# Altium project LIDO_HW_2022_04_V01.PrjPcb (part 1 of 3)
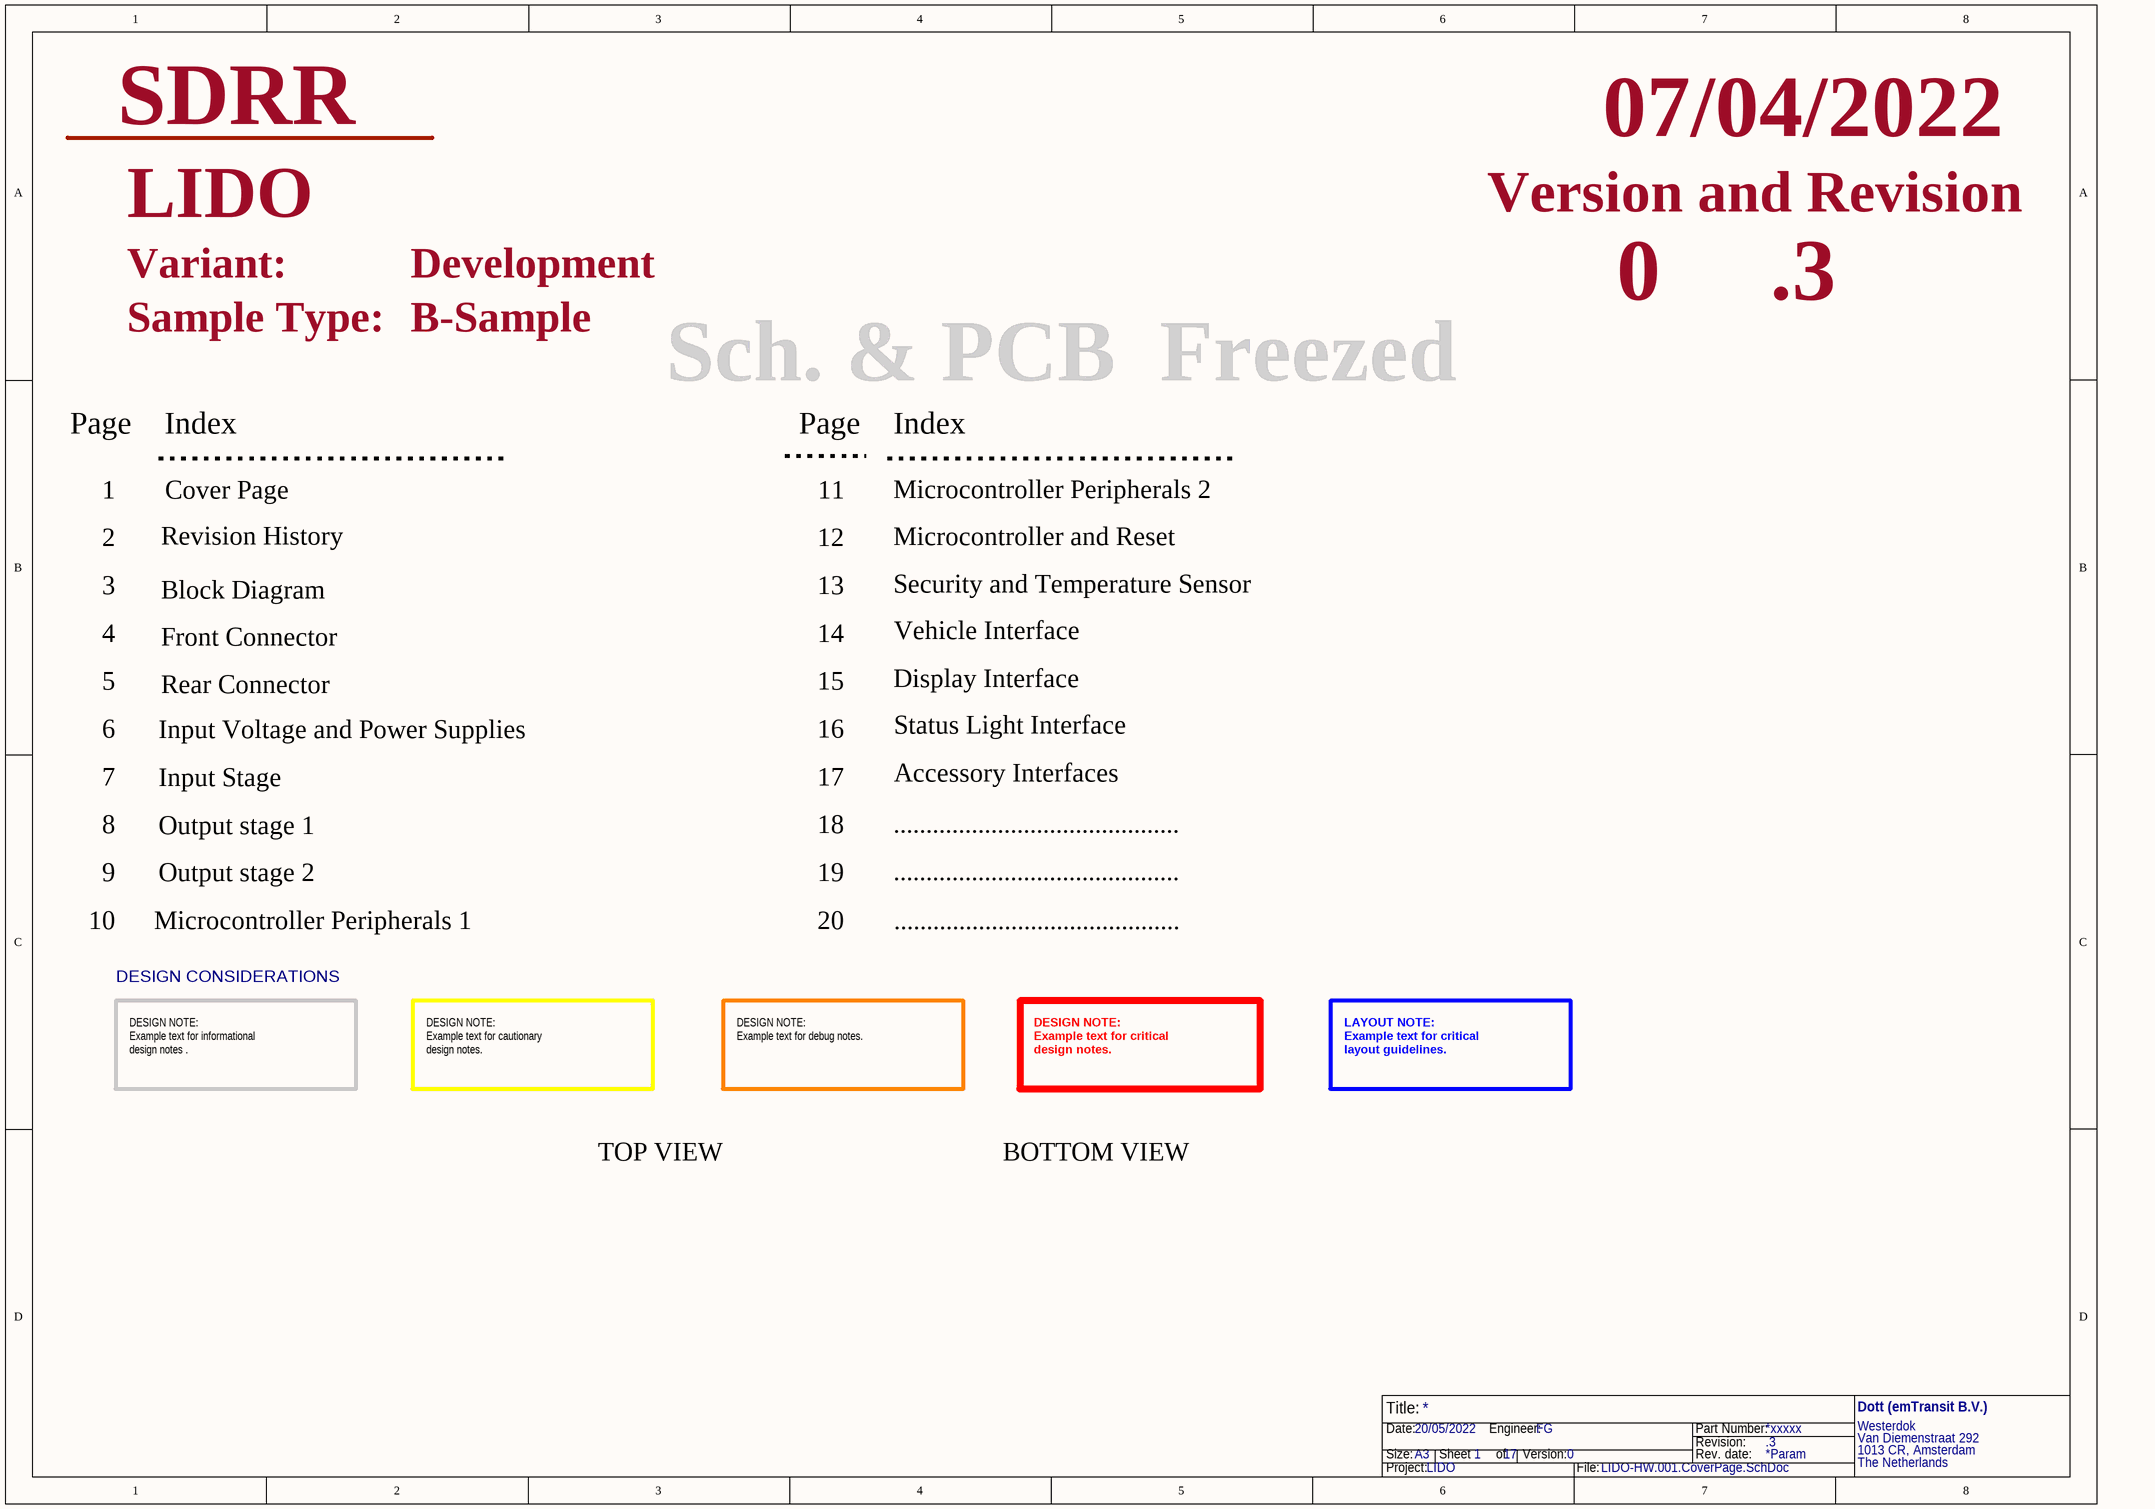
[diagram p0: LIDO-HW.001.CoverPage.SchDoc]
Company_Name: Dott (emTransit B.V.); CompanyAddress1: Westerdok; CompanyAddress2: Van Diemenstraat 292; CompanyAddress3: 1013 CR, Amsterdam; CompanyAddress4: The Netherlands; EngineeringSample: B-Sample; FileGeneration_Date: 04_07_2022; HardwareDesigner: FG; HardwareDesignerAbb: *Param; MainProjectName: SDRR; OutputJobFilesName: LIDO_V03; PopulateLabel: DNI; Project_Version: 0; Project_VersionDate: 20/05/2022; ProjectBoardName: LIDO; ProjectNumber: *xxxxx; ProjectRevision: .3; ProjectRevisionDate: *Param; ProjectStartDate: 07/04/2022; ProjectVariant: Development; Release_Date: 30/06/2022; Reviewer: *Param; ReviewerAbb: *Param
17 sheets, 459 parts. Net scope: hierarchical (ports join the sheet entries above them; power ports are global).
Board file: LIDO_HW_2022_04_V01.PcbDoc
Sheets:
  LIDO-HW.001.CoverPage.SchDoc
  LIDO-HW.002.RevisionHistory.SchDoc
  LIDO-HW.003.BlockDiagram.SchDoc
    U_LIDO-HW.100.FrontConnector = LIDO-HW.100.FrontConnector.SchDoc
    U_LIDO-HW.100.RearConnector = LIDO-HW.100.RearConnector.SchDoc
    U_LIDO-HW.100.VinAndPower = LIDO-HW.100.VinAndPower.SchDoc
    U_LIDO-HW.100.InputStage_1 = LIDO-HW.100.InputStage_1.SchDoc
    U_LIDO-HW.100.InputStage_2 = LIDO-HW.100.InputStage_2.SchDoc
    U_LIDO-HW.100.OutputStage = LIDO-HW.100.OutputStage.SchDoc
    U_LIDO-HW.200.MCU_Peripherals_1 = LIDO-HW.200.MCU_Peripherals_1.SchDoc
    U_LIDO-HW.200.MCU_Peripherals_2 = LIDO-HW.200.MCU_Peripherals_2.SchDoc
    U_LIDO-HW.200.MCU_SWD_Reset = LIDO-HW.200.MCU_SWD_Reset.SchDoc
    U_LIDO-HW.200.SecurityAndTemperature = LIDO-HW.200.SecurityAndTemperature.SchDoc
    U_LIDO-HW.300.VehicleInterface = LIDO-HW.300.VehicleInterface.SchDoc
    U_LIDO-HW.300.DisplayInterface = LIDO-HW.300.DisplayInterface.SchDoc
    U_LIDO-HW.300.StatusLightInterface = LIDO-HW.300.StatusLightInterface.SchDoc
    U_LIDO-HW.400.AccessoryInterfaces = LIDO-HW.400.AccessoryInterfaces.SchDoc

## Sheet LIDO-HW.001.CoverPage.SchDoc
size A3; CompanyName: EST-Floattech; DrawnBy: RR; Organization: EST-Floattech; Address2: Zandsteen 1; Address3: 2132 MZ; Address4: Hoofddorp; DocumentNumber: 21xxx; Revision: 1.0; SheetNumber: 1; SheetTotal: 17

### Notes on the sheet
- Version and Revision
- Variant:
- Sample Type:
- Page
- Index
- Sch. & PCB  Freezed
- 1
- Cover Page
- 11
- Microcontroller Peripherals 2
- 2
- Revision History
- 12
- Microcontroller and Reset
- 3
- 4
- Block Diagram
- Front Connector
- 13
- 14
- Security and Temperature Sensor
- Vehicle Interface
- 5
- Rear Connector
- 15
- Display Interface
- 6
- 7
- Input Voltage and Power Supplies
- Input Stage
- 16
- 17
- Status Light Interface
- Accessory Interfaces
- 8
- Output stage 1
- 18
- ............................................
- 9
- Output stage 2
- 19
- DESIGN CONSIDERATIONS
- 10
- Microcontroller Peripherals 1
- 20
- DESIGN NOTE:
  Example text for informational
  design notes .
- DESIGN NOTE:
  Example text for cautionary
  design notes.
- DESIGN NOTE:
  Example text for debug notes.
- DESIGN NOTE:
  Example text for critical
  design notes.
- LAYOUT NOTE:
  Example text for critical
  layout guidelines.
- TOP VIEW
- BOTTOM VIEW
- Title:
- Size:
- Date:
- A3
- Sheet       of
- Engineer:
- Version:
- Part Number:
- Revision:
- Rev. date:
- Project:
- File:

## Sheet LIDO-HW.002.RevisionHistory.SchDoc
size A3; CompanyName: EST-Floattech; DrawnBy: RR; Organization: EST-Floattech; Address2: Zandsteen 1; Address3: 2132 MZ; Address4: Hoofddorp; DocumentNumber: 21xxx; Revision: 1.0; SheetNumber: 2; SheetTotal: 17
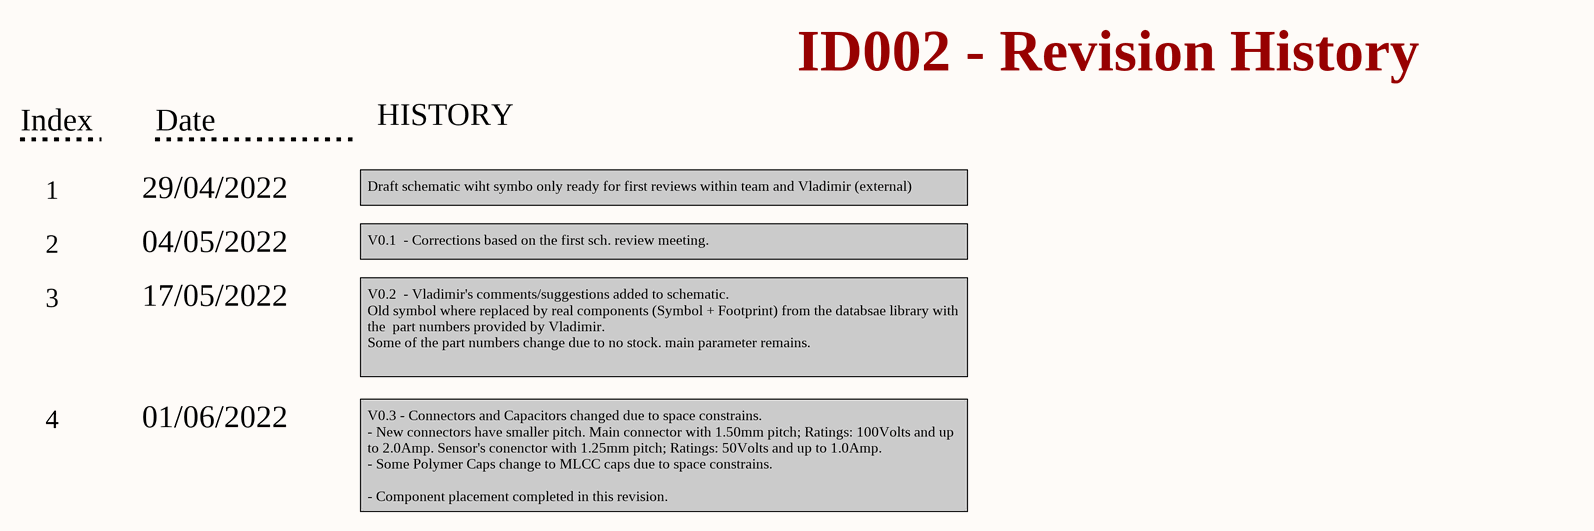
[diagram p1: LIDO-HW.002.RevisionHistory.SchDoc]

### Notes on the sheet
- Index
- Date
- HISTORY
- ID002 - Revision History
- 1
- 29/04/2022
- Draft schematic wiht symbo only ready for first reviews within team and Vladimir (external)
- 2
- 04/05/2022
- V0.1  - Corrections based on the first sch. review meeting.
- 3
- 17/05/2022
- V0.2  - Vladimir's comments/suggestions added to schematic.
  Old symbol where replaced by real components (Symbol + Footprint) from the databsae library with the  part numbers provided by Vladimir.
  Some of the part numbers change due to no stock. main parameter remains.
- 4
- 01/06/2022
- V0.3 - Connectors and Capacitors changed due to space constrains.
  - New connectors have smaller pitch. Main connector with 1.50mm pitch; Ratings: 100Volts and up to 2.0Amp. Sensor's conenctor with 1.25mm pitch; Ratings: 50Volts and up to 1.0Amp.
  - Some Polymer Caps change to MLCC caps due to space constrains.
  - Component placement completed in this revision.
- Title:
- Size:
- Date:
- A3
- Sheet       of
- Engineer:
- Version:
- Part Number:
- Revision:
- Rev. date:
- Project:
- File:

## Sheet LIDO-HW.003.BlockDiagram.SchDoc
size A3; CompanyName: EST-Floattech; DrawnBy: RR; Organization: EST-Floattech; Address2: Zandsteen 1; Address3: 2132 MZ; Address4: Hoofddorp; DocumentNumber: 21xxx; Revision: 1.0; SheetNumber: 3; SheetTotal: 17
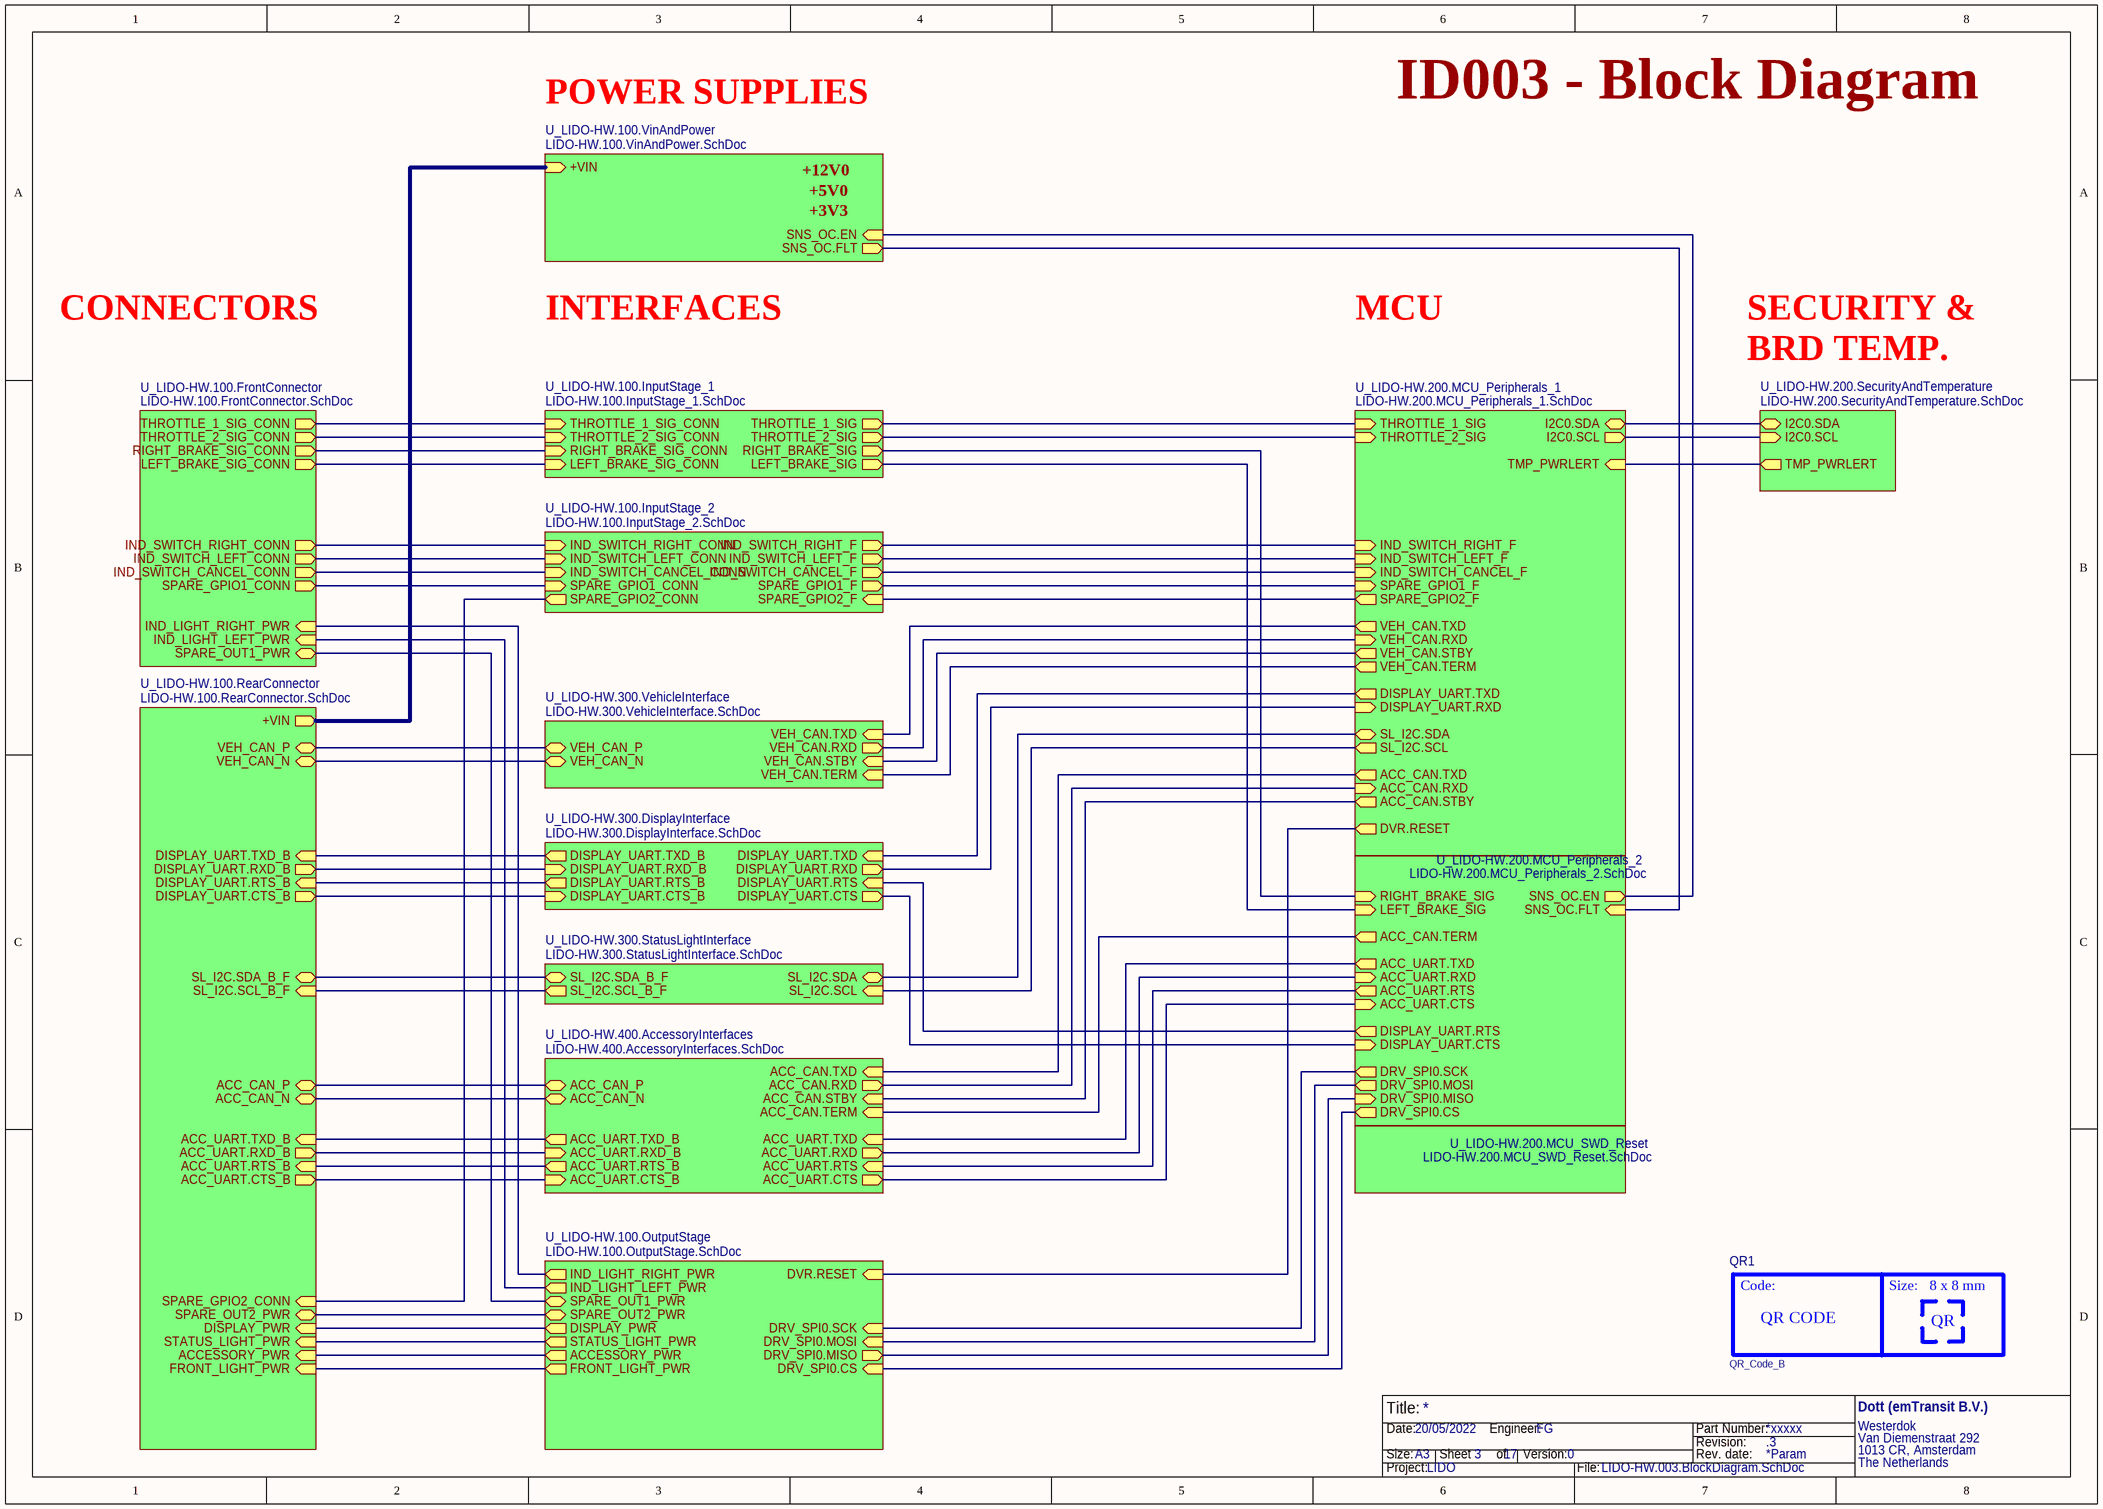
[diagram p2: LIDO-HW.003.BlockDiagram.SchDoc]

### Parts
QR1  QR_Code_B  [QR_CODE_8X8_A]  (no BOM)

### Sub-sheets
U_LIDO-HW.100.FrontConnector = LIDO-HW.100.FrontConnector.SchDoc: IND_LIGHT_LEFT_PWR (in), IND_LIGHT_RIGHT_PWR (in), THROTTLE_1_SIG_CONN (out), THROTTLE_2_SIG_CONN (out), RIGHT_BRAKE_SIG_CONN (out), LEFT_BRAKE_SIG_CONN (out), SPARE_OUT1_PWR (bidir), IND_SWITCH_CANCEL_CONN (out), SPARE_GPIO1_CONN (out), IND_SWITCH_LEFT_CONN (out), IND_SWITCH_RIGHT_CONN (out)
U_LIDO-HW.100.InputStage_1 = LIDO-HW.100.InputStage_1.SchDoc: THROTTLE_1_SIG (out), THROTTLE_1_SIG_CONN (in), THROTTLE_2_SIG (out), THROTTLE_2_SIG_CONN (in), RIGHT_BRAKE_SIG (out), RIGHT_BRAKE_SIG_CONN (in), LEFT_BRAKE_SIG (out), LEFT_BRAKE_SIG_CONN (in)
U_LIDO-HW.100.InputStage_2 = LIDO-HW.100.InputStage_2.SchDoc: IND_SWITCH_LEFT_F (out), IND_SWITCH_LEFT_CONN (in), IND_SWITCH_RIGHT_CONN (in), IND_SWITCH_RIGHT_F (out), SPARE_GPIO1_CONN (in), IND_SWITCH_CANCEL_CONN (in), IND_SWITCH_CANCEL_F (out), SPARE_GPIO2_CONN (out), SPARE_GPIO1_F (out), SPARE_GPIO2_F (in)
U_LIDO-HW.100.OutputStage = LIDO-HW.100.OutputStage.SchDoc: FRONT_LIGHT_PWR (out), IND_LIGHT_LEFT_PWR (out), IND_LIGHT_RIGHT_PWR (out), ACCESSORY_PWR (out), STATUS_LIGHT_PWR (out), SPARE_OUT2_PWR (bidir), SPARE_OUT1_PWR (bidir), DISPLAY_PWR (out), DRV_SPI0.MISO (out), DRV_SPI0.SCK (in), DRV_SPI0.MOSI (in), DRV_SPI0.CS (in), DVR.RESET (in)
U_LIDO-HW.100.RearConnector = LIDO-HW.100.RearConnector.SchDoc: ACC_CAN_P (bidir), ACC_CAN_N (bidir), ACC_UART.TXD_B (in), ACC_UART.RXD_B (out), ACC_UART.CTS_B (out), ACC_UART.RTS_B (in), SL_I2C.SDA_B_F (bidir), SL_I2C.SCL_B_F (in), FRONT_LIGHT_PWR (in), VEH_CAN_P (bidir), VEH_CAN_N (bidir), DISPLAY_UART.TXD_B (in), DISPLAY_UART.RXD_B (out), DISPLAY_PWR (in), STATUS_LIGHT_PWR (in), ACCESSORY_PWR (in), SPARE_OUT2_PWR (bidir), SPARE_GPIO2_CONN (in), DISPLAY_UART.RTS_B (in), DISPLAY_UART.CTS_B (out), +VIN (out)
U_LIDO-HW.100.VinAndPower = LIDO-HW.100.VinAndPower.SchDoc: SNS_OC.FLT (out), SNS_OC.EN (in), +VIN (in)
U_LIDO-HW.200.MCU_Peripherals_1 = LIDO-HW.200.MCU_Peripherals_1.SchDoc: I2C0.SDA (bidir), I2C0.SCL (out), TMP_PWRLERT (in), VEH_CAN.TXD (out), VEH_CAN.RXD (in), VEH_CAN.STBY (out), ACC_CAN.TXD (out), ACC_CAN.RXD (in), ACC_CAN.STBY (out), VEH_CAN.TERM (out), SL_I2C.SDA (bidir), SL_I2C.SCL (out), DISPLAY_UART.TXD (out), DISPLAY_UART.RXD (in), THROTTLE_1_SIG (in), THROTTLE_2_SIG (in), IND_SWITCH_LEFT_F (in), IND_SWITCH_RIGHT_F (in), IND_SWITCH_CANCEL_F (in), DVR.RESET (out), SPARE_GPIO1_F (in), SPARE_GPIO2_F (out)
U_LIDO-HW.200.MCU_Peripherals_2 = LIDO-HW.200.MCU_Peripherals_2.SchDoc: ACC_UART.TXD (out), ACC_UART.RXD (in), ACC_UART.CTS (in), ACC_UART.RTS (out), DRV_SPI0.CS (out), RIGHT_BRAKE_SIG (in), LEFT_BRAKE_SIG (in), DRV_SPI0.MISO (in), DRV_SPI0.SCK (out), DRV_SPI0.MOSI (out), DISPLAY_UART.CTS (in), DISPLAY_UART.RTS (out), SNS_OC.FLT (in), SNS_OC.EN (out), ACC_CAN.TERM (out)
U_LIDO-HW.200.MCU_SWD_Reset = LIDO-HW.200.MCU_SWD_Reset.SchDoc: no entries
U_LIDO-HW.200.SecurityAndTemperature = LIDO-HW.200.SecurityAndTemperature.SchDoc: I2C0.SDA (bidir), I2C0.SCL (in), TMP_PWRLERT (out)
U_LIDO-HW.300.DisplayInterface = LIDO-HW.300.DisplayInterface.SchDoc: DISPLAY_UART.TXD (in), DISPLAY_UART.RXD (out), DISPLAY_UART.CTS (out), DISPLAY_UART.RTS (in), DISPLAY_UART.TXD_B (out), DISPLAY_UART.RXD_B (in), DISPLAY_UART.CTS_B (in), DISPLAY_UART.RTS_B (out)
U_LIDO-HW.300.StatusLightInterface = LIDO-HW.300.StatusLightInterface.SchDoc: SL_I2C.SDA (bidir), SL_I2C.SCL (in), SL_I2C.SDA_B_F (bidir), SL_I2C.SCL_B_F (out)
U_LIDO-HW.300.VehicleInterface = LIDO-HW.300.VehicleInterface.SchDoc: VEH_CAN.TXD (in), VEH_CAN.RXD (out), VEH_CAN.STBY (in), VEH_CAN.TERM (in), VEH_CAN_P (bidir), VEH_CAN_N (bidir)
U_LIDO-HW.400.AccessoryInterfaces = LIDO-HW.400.AccessoryInterfaces.SchDoc: ACC_CAN.TXD (in), ACC_CAN.RXD (out), ACC_CAN.STBY (in), ACC_UART.TXD (in), ACC_UART.RXD (out), ACC_UART.CTS (out), ACC_UART.RTS (in), ACC_UART.TXD_B (out), ACC_UART.RXD_B (in), ACC_UART.CTS_B (in), ACC_UART.RTS_B (out), ACC_CAN_P (bidir), ACC_CAN_N (bidir), ACC_CAN.TERM (in)

### Nets
+VIN: sheet U_LIDO-HW.100.RearConnector/+VIN, sheet U_LIDO-HW.100.VinAndPower/+VIN
ACC_CAN.RXD: sheet U_LIDO-HW.200.MCU_Peripherals_1/ACC_CAN.RXD, sheet U_LIDO-HW.400.AccessoryInterfaces/ACC_CAN.RXD
ACC_CAN.STBY: sheet U_LIDO-HW.200.MCU_Peripherals_1/ACC_CAN.STBY, sheet U_LIDO-HW.400.AccessoryInterfaces/ACC_CAN.STBY
ACC_CAN.TERM: sheet U_LIDO-HW.200.MCU_Peripherals_2/ACC_CAN.TERM, sheet U_LIDO-HW.400.AccessoryInterfaces/ACC_CAN.TERM
ACC_CAN.TXD: sheet U_LIDO-HW.200.MCU_Peripherals_1/ACC_CAN.TXD, sheet U_LIDO-HW.400.AccessoryInterfaces/ACC_CAN.TXD
ACC_CAN_N: sheet U_LIDO-HW.100.RearConnector/ACC_CAN_N, sheet U_LIDO-HW.400.AccessoryInterfaces/ACC_CAN_N
ACC_CAN_P: sheet U_LIDO-HW.100.RearConnector/ACC_CAN_P, sheet U_LIDO-HW.400.AccessoryInterfaces/ACC_CAN_P
ACC_UART.CTS: sheet U_LIDO-HW.200.MCU_Peripherals_2/ACC_UART.CTS, sheet U_LIDO-HW.400.AccessoryInterfaces/ACC_UART.CTS
ACC_UART.CTS_B: sheet U_LIDO-HW.100.RearConnector/ACC_UART.CTS_B, sheet U_LIDO-HW.400.AccessoryInterfaces/ACC_UART.CTS_B
ACC_UART.RTS: sheet U_LIDO-HW.200.MCU_Peripherals_2/ACC_UART.RTS, sheet U_LIDO-HW.400.AccessoryInterfaces/ACC_UART.RTS
ACC_UART.RTS_B: sheet U_LIDO-HW.100.RearConnector/ACC_UART.RTS_B, sheet U_LIDO-HW.400.AccessoryInterfaces/ACC_UART.RTS_B
ACC_UART.RXD: sheet U_LIDO-HW.200.MCU_Peripherals_2/ACC_UART.RXD, sheet U_LIDO-HW.400.AccessoryInterfaces/ACC_UART.RXD
ACC_UART.RXD_B: sheet U_LIDO-HW.100.RearConnector/ACC_UART.RXD_B, sheet U_LIDO-HW.400.AccessoryInterfaces/ACC_UART.RXD_B
ACC_UART.TXD: sheet U_LIDO-HW.200.MCU_Peripherals_2/ACC_UART.TXD, sheet U_LIDO-HW.400.AccessoryInterfaces/ACC_UART.TXD
ACC_UART.TXD_B: sheet U_LIDO-HW.100.RearConnector/ACC_UART.TXD_B, sheet U_LIDO-HW.400.AccessoryInterfaces/ACC_UART.TXD_B
ACCESSORY_PWR: sheet U_LIDO-HW.100.RearConnector/ACCESSORY_PWR, sheet U_LIDO-HW.100.OutputStage/ACCESSORY_PWR
DISPLAY_PWR: sheet U_LIDO-HW.100.RearConnector/DISPLAY_PWR, sheet U_LIDO-HW.100.OutputStage/DISPLAY_PWR
DISPLAY_UART.CTS: sheet U_LIDO-HW.200.MCU_Peripherals_2/DISPLAY_UART.CTS, sheet U_LIDO-HW.300.DisplayInterface/DISPLAY_UART.CTS
DISPLAY_UART.CTS_B: sheet U_LIDO-HW.100.RearConnector/DISPLAY_UART.CTS_B, sheet U_LIDO-HW.300.DisplayInterface/DISPLAY_UART.CTS_B
DISPLAY_UART.RTS: sheet U_LIDO-HW.200.MCU_Peripherals_2/DISPLAY_UART.RTS, sheet U_LIDO-HW.300.DisplayInterface/DISPLAY_UART.RTS
DISPLAY_UART.RTS_B: sheet U_LIDO-HW.100.RearConnector/DISPLAY_UART.RTS_B, sheet U_LIDO-HW.300.DisplayInterface/DISPLAY_UART.RTS_B
DISPLAY_UART.RXD: sheet U_LIDO-HW.200.MCU_Peripherals_1/DISPLAY_UART.RXD, sheet U_LIDO-HW.300.DisplayInterface/DISPLAY_UART.RXD
DISPLAY_UART.RXD_B: sheet U_LIDO-HW.100.RearConnector/DISPLAY_UART.RXD_B, sheet U_LIDO-HW.300.DisplayInterface/DISPLAY_UART.RXD_B
DISPLAY_UART.TXD: sheet U_LIDO-HW.200.MCU_Peripherals_1/DISPLAY_UART.TXD, sheet U_LIDO-HW.300.DisplayInterface/DISPLAY_UART.TXD
DISPLAY_UART.TXD_B: sheet U_LIDO-HW.100.RearConnector/DISPLAY_UART.TXD_B, sheet U_LIDO-HW.300.DisplayInterface/DISPLAY_UART.TXD_B
DRV_SPI0.CS: sheet U_LIDO-HW.100.OutputStage/DRV_SPI0.CS, sheet U_LIDO-HW.200.MCU_Peripherals_2/DRV_SPI0.CS
DRV_SPI0.MISO: sheet U_LIDO-HW.100.OutputStage/DRV_SPI0.MISO, sheet U_LIDO-HW.200.MCU_Peripherals_2/DRV_SPI0.MISO
DRV_SPI0.MOSI: sheet U_LIDO-HW.100.OutputStage/DRV_SPI0.MOSI, sheet U_LIDO-HW.200.MCU_Peripherals_2/DRV_SPI0.MOSI
DRV_SPI0.SCK: sheet U_LIDO-HW.100.OutputStage/DRV_SPI0.SCK, sheet U_LIDO-HW.200.MCU_Peripherals_2/DRV_SPI0.SCK
DVR.RESET: sheet U_LIDO-HW.100.OutputStage/DVR.RESET, sheet U_LIDO-HW.200.MCU_Peripherals_1/DVR.RESET
FRONT_LIGHT_PWR: sheet U_LIDO-HW.100.RearConnector/FRONT_LIGHT_PWR, sheet U_LIDO-HW.100.OutputStage/FRONT_LIGHT_PWR
I2C0.SCL: sheet U_LIDO-HW.200.MCU_Peripherals_1/I2C0.SCL, sheet U_LIDO-HW.200.SecurityAndTemperature/I2C0.SCL
I2C0.SDA: sheet U_LIDO-HW.200.MCU_Peripherals_1/I2C0.SDA, sheet U_LIDO-HW.200.SecurityAndTemperature/I2C0.SDA
IND_LIGHT_LEFT_PWR: sheet U_LIDO-HW.100.FrontConnector/IND_LIGHT_LEFT_PWR, sheet U_LIDO-HW.100.OutputStage/IND_LIGHT_LEFT_PWR
IND_LIGHT_RIGHT_PWR: sheet U_LIDO-HW.100.FrontConnector/IND_LIGHT_RIGHT_PWR, sheet U_LIDO-HW.100.OutputStage/IND_LIGHT_RIGHT_PWR
IND_SWITCH_CANCEL_CONN: sheet U_LIDO-HW.100.FrontConnector/IND_SWITCH_CANCEL_CONN, sheet U_LIDO-HW.100.InputStage_2/IND_SWITCH_CANCEL_CONN
IND_SWITCH_CANCEL_F: sheet U_LIDO-HW.100.InputStage_2/IND_SWITCH_CANCEL_F, sheet U_LIDO-HW.200.MCU_Peripherals_1/IND_SWITCH_CANCEL_F
IND_SWITCH_LEFT_CONN: sheet U_LIDO-HW.100.FrontConnector/IND_SWITCH_LEFT_CONN, sheet U_LIDO-HW.100.InputStage_2/IND_SWITCH_LEFT_CONN
IND_SWITCH_LEFT_F: sheet U_LIDO-HW.100.InputStage_2/IND_SWITCH_LEFT_F, sheet U_LIDO-HW.200.MCU_Peripherals_1/IND_SWITCH_LEFT_F
IND_SWITCH_RIGHT_CONN: sheet U_LIDO-HW.100.FrontConnector/IND_SWITCH_RIGHT_CONN, sheet U_LIDO-HW.100.InputStage_2/IND_SWITCH_RIGHT_CONN
IND_SWITCH_RIGHT_F: sheet U_LIDO-HW.100.InputStage_2/IND_SWITCH_RIGHT_F, sheet U_LIDO-HW.200.MCU_Peripherals_1/IND_SWITCH_RIGHT_F
LEFT_BRAKE_SIG: sheet U_LIDO-HW.100.InputStage_1/LEFT_BRAKE_SIG, sheet U_LIDO-HW.200.MCU_Peripherals_2/LEFT_BRAKE_SIG
LEFT_BRAKE_SIG_CONN: sheet U_LIDO-HW.100.FrontConnector/LEFT_BRAKE_SIG_CONN, sheet U_LIDO-HW.100.InputStage_1/LEFT_BRAKE_SIG_CONN
RIGHT_BRAKE_SIG: sheet U_LIDO-HW.100.InputStage_1/RIGHT_BRAKE_SIG, sheet U_LIDO-HW.200.MCU_Peripherals_2/RIGHT_BRAKE_SIG
RIGHT_BRAKE_SIG_CONN: sheet U_LIDO-HW.100.FrontConnector/RIGHT_BRAKE_SIG_CONN, sheet U_LIDO-HW.100.InputStage_1/RIGHT_BRAKE_SIG_CONN
SL_I2C.SCL: sheet U_LIDO-HW.200.MCU_Peripherals_1/SL_I2C.SCL, sheet U_LIDO-HW.300.StatusLightInterface/SL_I2C.SCL
SL_I2C.SCL_B_F: sheet U_LIDO-HW.100.RearConnector/SL_I2C.SCL_B_F, sheet U_LIDO-HW.300.StatusLightInterface/SL_I2C.SCL_B_F
SL_I2C.SDA: sheet U_LIDO-HW.200.MCU_Peripherals_1/SL_I2C.SDA, sheet U_LIDO-HW.300.StatusLightInterface/SL_I2C.SDA
SL_I2C.SDA_B_F: sheet U_LIDO-HW.100.RearConnector/SL_I2C.SDA_B_F, sheet U_LIDO-HW.300.StatusLightInterface/SL_I2C.SDA_B_F
SNS_OC.EN: sheet U_LIDO-HW.100.VinAndPower/SNS_OC.EN, sheet U_LIDO-HW.200.MCU_Peripherals_2/SNS_OC.EN
SNS_OC.FLT: sheet U_LIDO-HW.100.VinAndPower/SNS_OC.FLT, sheet U_LIDO-HW.200.MCU_Peripherals_2/SNS_OC.FLT
SPARE_GPIO1_CONN: sheet U_LIDO-HW.100.FrontConnector/SPARE_GPIO1_CONN, sheet U_LIDO-HW.100.InputStage_2/SPARE_GPIO1_CONN
SPARE_GPIO1_F: sheet U_LIDO-HW.100.InputStage_2/SPARE_GPIO1_F, sheet U_LIDO-HW.200.MCU_Peripherals_1/SPARE_GPIO1_F
SPARE_GPIO2_CONN: sheet U_LIDO-HW.100.RearConnector/SPARE_GPIO2_CONN, sheet U_LIDO-HW.100.InputStage_2/SPARE_GPIO2_CONN
SPARE_GPIO2_F: sheet U_LIDO-HW.100.InputStage_2/SPARE_GPIO2_F, sheet U_LIDO-HW.200.MCU_Peripherals_1/SPARE_GPIO2_F
SPARE_OUT1_PWR: sheet U_LIDO-HW.100.FrontConnector/SPARE_OUT1_PWR, sheet U_LIDO-HW.100.OutputStage/SPARE_OUT1_PWR
SPARE_OUT2_PWR: sheet U_LIDO-HW.100.RearConnector/SPARE_OUT2_PWR, sheet U_LIDO-HW.100.OutputStage/SPARE_OUT2_PWR
STATUS_LIGHT_PWR: sheet U_LIDO-HW.100.RearConnector/STATUS_LIGHT_PWR, sheet U_LIDO-HW.100.OutputStage/STATUS_LIGHT_PWR
THROTTLE_1_SIG: sheet U_LIDO-HW.100.InputStage_1/THROTTLE_1_SIG, sheet U_LIDO-HW.200.MCU_Peripherals_1/THROTTLE_1_SIG
THROTTLE_1_SIG_CONN: sheet U_LIDO-HW.100.FrontConnector/THROTTLE_1_SIG_CONN, sheet U_LIDO-HW.100.InputStage_1/THROTTLE_1_SIG_CONN
THROTTLE_2_SIG: sheet U_LIDO-HW.100.InputStage_1/THROTTLE_2_SIG, sheet U_LIDO-HW.200.MCU_Peripherals_1/THROTTLE_2_SIG
THROTTLE_2_SIG_CONN: sheet U_LIDO-HW.100.FrontConnector/THROTTLE_2_SIG_CONN, sheet U_LIDO-HW.100.InputStage_1/THROTTLE_2_SIG_CONN
TMP_PWRLERT: sheet U_LIDO-HW.200.MCU_Peripherals_1/TMP_PWRLERT, sheet U_LIDO-HW.200.SecurityAndTemperature/TMP_PWRLERT
VEH_CAN.RXD: sheet U_LIDO-HW.200.MCU_Peripherals_1/VEH_CAN.RXD, sheet U_LIDO-HW.300.VehicleInterface/VEH_CAN.RXD
VEH_CAN.STBY: sheet U_LIDO-HW.200.MCU_Peripherals_1/VEH_CAN.STBY, sheet U_LIDO-HW.300.VehicleInterface/VEH_CAN.STBY
VEH_CAN.TERM: sheet U_LIDO-HW.200.MCU_Peripherals_1/VEH_CAN.TERM, sheet U_LIDO-HW.300.VehicleInterface/VEH_CAN.TERM
VEH_CAN.TXD: sheet U_LIDO-HW.200.MCU_Peripherals_1/VEH_CAN.TXD, sheet U_LIDO-HW.300.VehicleInterface/VEH_CAN.TXD
VEH_CAN_N: sheet U_LIDO-HW.100.RearConnector/VEH_CAN_N, sheet U_LIDO-HW.300.VehicleInterface/VEH_CAN_N
VEH_CAN_P: sheet U_LIDO-HW.100.RearConnector/VEH_CAN_P, sheet U_LIDO-HW.300.VehicleInterface/VEH_CAN_P

### Notes on the sheet
- POWER SUPPLIES
- ID003 - Block Diagram
- +12V0
- +5V0
- +3V3
- CONNECTORS
- INTERFACES
- MCU
- SECURITY &
- BRD TEMP.
- Title:
- Size:
- Date:
- A3
- Sheet       of
- Engineer:
- Version:
- Part Number:
- Revision:
- Rev. date:
- Project:
- File:
- (in symbol 25) Code:; Size:; 8 x 8 mm; QR CODE; QR

### Library data of the parts
QR1 = 25: QR Code 8x8mm; Part Value: Legend; Obsolete Part: False; Component ID: 25; Label: QR_Code_B; Part Type: no BOM

## Sheet LIDO-HW.100.FrontConnector.SchDoc
size A3; CompanyName: EST-Floattech; DrawnBy: RR; Organization: EST-Floattech; Address2: Zandsteen 1; Address3: 2132 MZ; Address4: Hoofddorp; DocumentNumber: 21xxx; Revision: 1.0; SheetNumber: 4; SheetTotal: 17
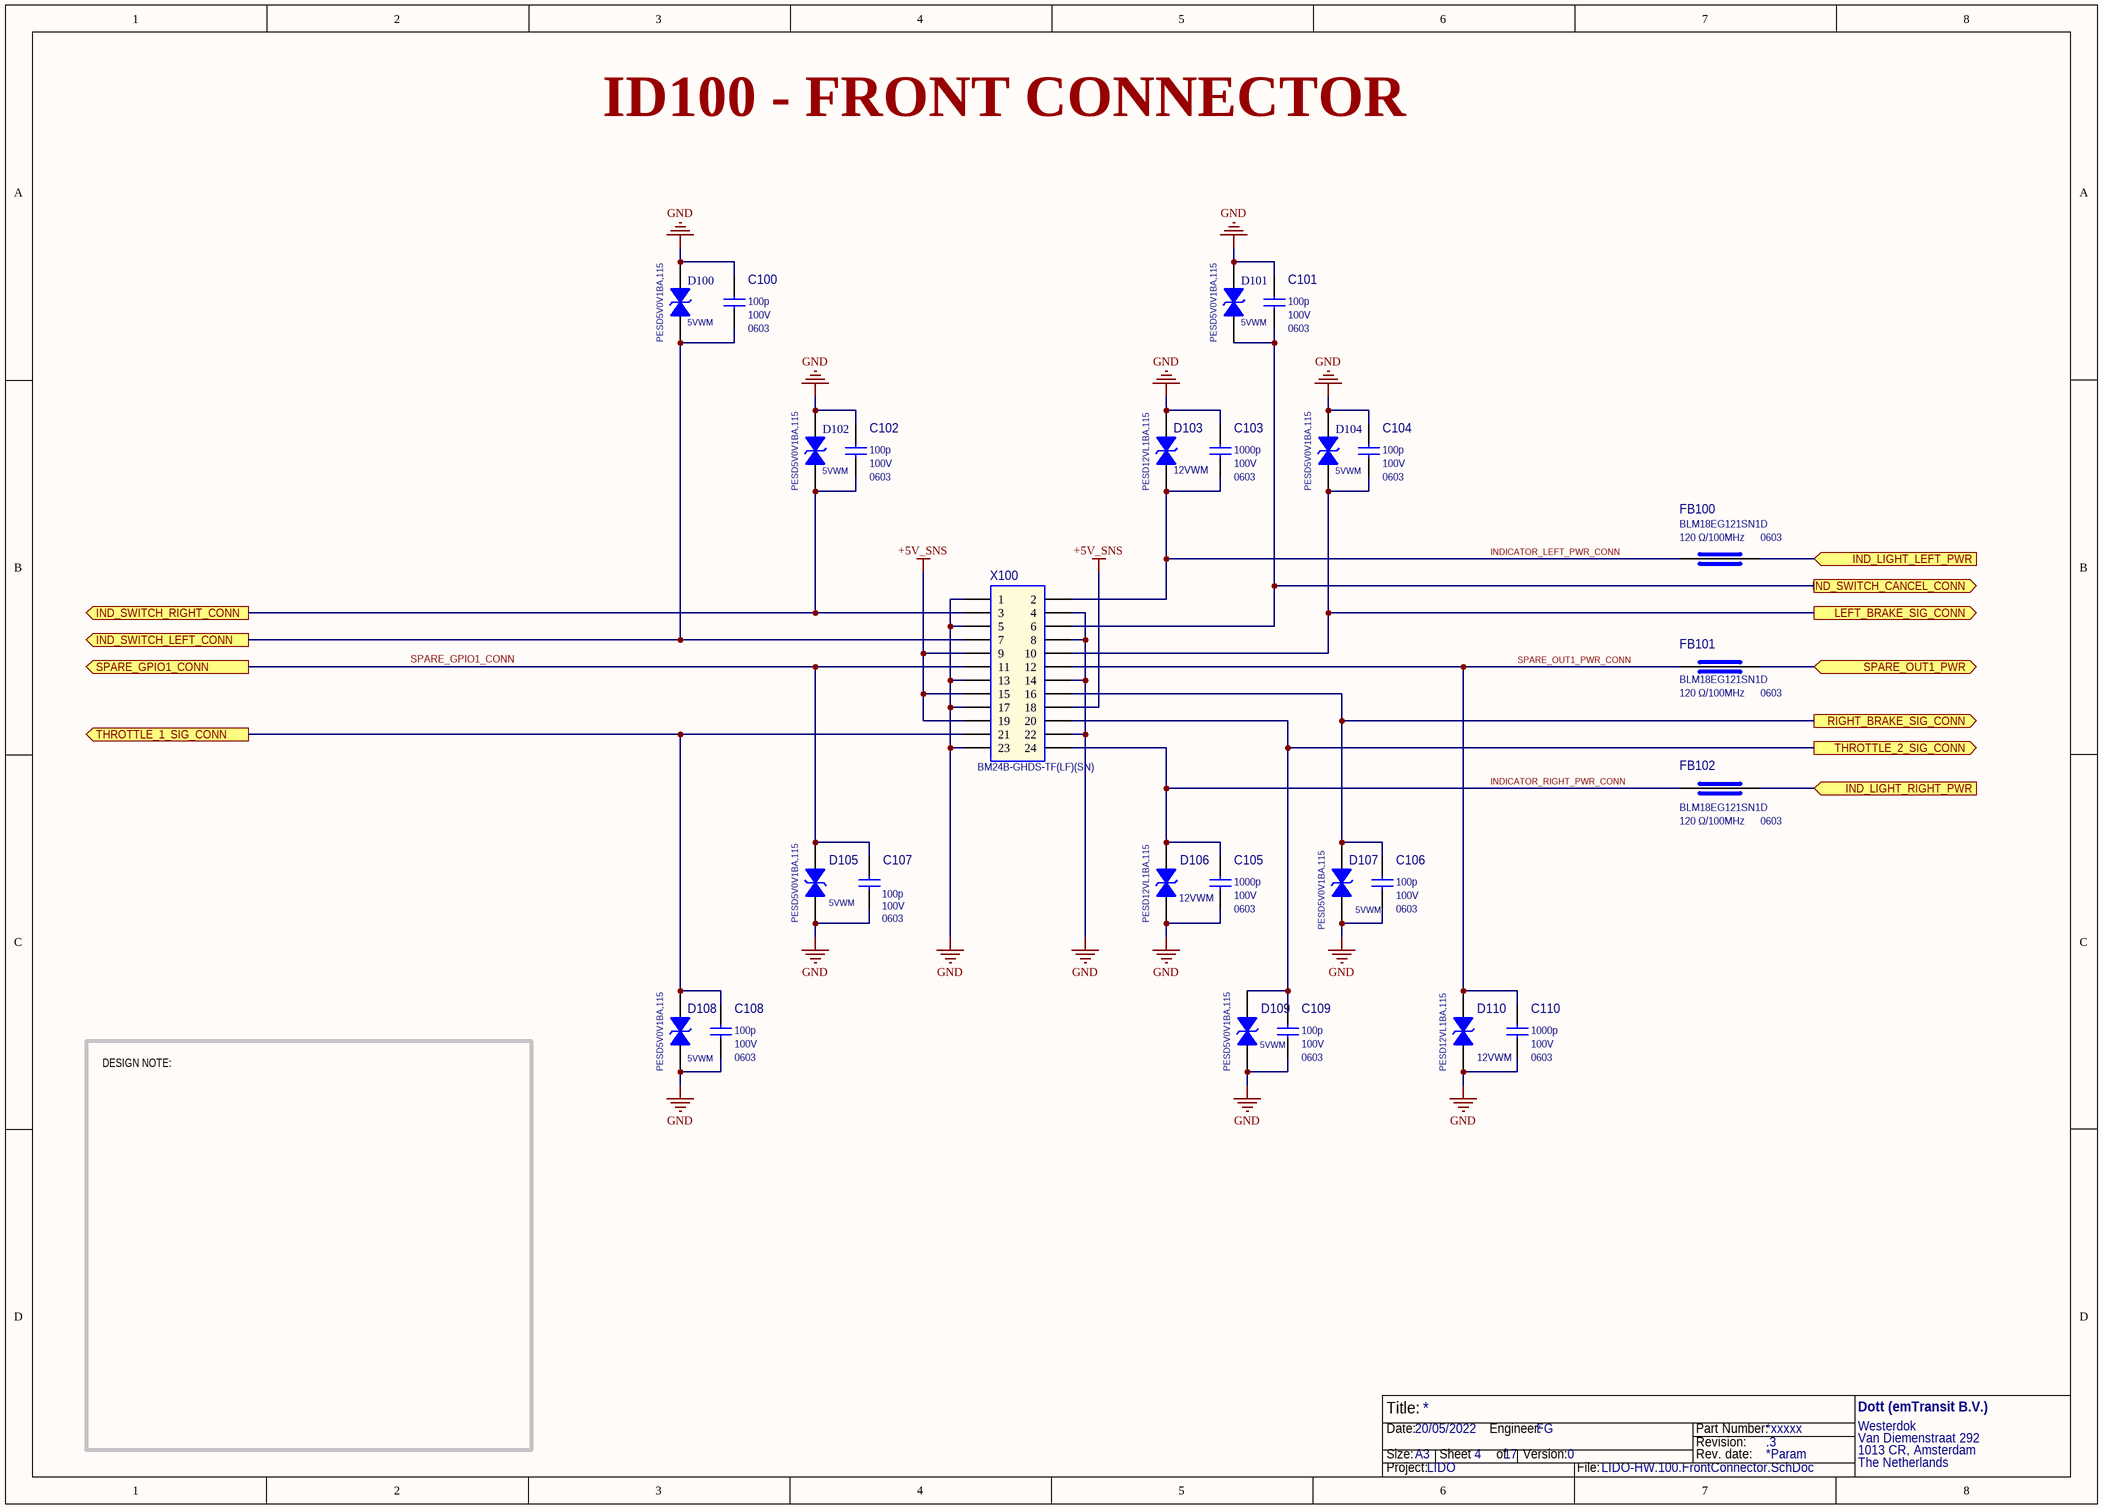
[diagram p3: LIDO-HW.100.FrontConnector.SchDoc]

### Parts
C100  Part Value 2: 100V  Part Package: 0603  [CAP_0603_1608X90-N_MURATA_A]  (hidden comment: 100p)
C101  Part Value 2: 100V  Part Package: 0603  [CAP_0603_1608X90-N_MURATA_A]  (hidden comment: 100p)
C102  Part Value 2: 100V  Part Package: 0603  [CAP_0603_1608X90-N_MURATA_A]  (hidden comment: 100p)
C103  Part Value 2: 100V  Part Package: 0603  [CAP_0603_1608X90-N_MURATA_A]  (hidden comment: 1000p)
C104  Part Value 2: 100V  Part Package: 0603  [CAP_0603_1608X90-N_MURATA_A]  (hidden comment: 100p)
C105  Part Value 2: 100V  Part Package: 0603  [CAP_0603_1608X90-N_MURATA_A]  (hidden comment: 1000p)
C106  Part Value 2: 100V  Part Package: 0603  [CAP_0603_1608X90-N_MURATA_A]  (hidden comment: 100p)
C107  Part Value 2: 100V  Part Package: 0603  [CAP_0603_1608X90-N_MURATA_A]  (hidden comment: 100p)
C108  Part Value 2: 100V  Part Package: 0603  [CAP_0603_1608X90-N_MURATA_A]  (hidden comment: 100p)
C109  Part Value 2: 100V  Part Package: 0603  [CAP_0603_1608X90-N_MURATA_A]  (hidden comment: 100p)
C110  Part Value 2: 100V  Part Package: 0603  [CAP_0603_1608X90-N_MURATA_A]  (hidden comment: 1000p)
D100  Manufacturer Part Number: PESD5V0V1BA,115  [NXP_SOD-323_250X125X95L30x32_A]  (hidden comment: 5VWM)
D101  Manufacturer Part Number: PESD5V0V1BA,115  [NXP_SOD-323_250X125X95L30x32_A]  (hidden comment: 5VWM)
D102  Manufacturer Part Number: PESD5V0V1BA,115  [NXP_SOD-323_250X125X95L30x32_A]  (hidden comment: 5VWM)
D103  Manufacturer Part Number: PESD12VL1BA,115  [NXP_SOD-323_250X125X95L30x32_A]  (hidden comment: 12VWM)
D104  Manufacturer Part Number: PESD5V0V1BA,115  [NXP_SOD-323_250X125X95L30x32_A]  (hidden comment: 5VWM)
D105  Manufacturer Part Number: PESD5V0V1BA,115  [NXP_SOD-323_250X125X95L30x32_A]  (hidden comment: 5VWM)
D106  Manufacturer Part Number: PESD12VL1BA,115  [NXP_SOD-323_250X125X95L30x32_A]  (hidden comment: 12VWM)
D107  Manufacturer Part Number: PESD5V0V1BA,115  [NXP_SOD-323_250X125X95L30x32_A]  (hidden comment: 5VWM)
D108  Manufacturer Part Number: PESD5V0V1BA,115  [NXP_SOD-323_250X125X95L30x32_A]  (hidden comment: 5VWM)
D109  Manufacturer Part Number: PESD5V0V1BA,115  [NXP_SOD-323_250X125X95L30x32_A]  (hidden comment: 5VWM)
D110  Manufacturer Part Number: PESD12VL1BA,115  [NXP_SOD-323_250X125X95L30x32_A]  (hidden comment: 12VWM)
FB100  Manufacturer Part Number: BLM18EG121SN1D  Part Package: 0603  [IND_0603_1608X95-N_AVX_A]  (hidden comment: 120 Ω/100MHz)
FB101  Manufacturer Part Number: BLM18EG121SN1D  Part Package: 0603  [IND_0603_1608X95-N_AVX_A]  (hidden comment: 120 Ω/100MHz)
FB102  Manufacturer Part Number: BLM18EG121SN1D  Part Package: 0603  [IND_0603_1608X95-N_AVX_A]  (hidden comment: 120 Ω/100MHz)
X100  BM24B-GHDS-TF(LF)(SN)  [JST_BM24B-GHDS-TF_A]

### Ports
IND_LIGHT_LEFT_PWR (in), IND_LIGHT_RIGHT_PWR (in), IND_SWITCH_CANCEL_CONN (out), IND_SWITCH_LEFT_CONN (out), IND_SWITCH_RIGHT_CONN (out), LEFT_BRAKE_SIG_CONN (out), RIGHT_BRAKE_SIG_CONN (out), SPARE_GPIO1_CONN (out), SPARE_OUT1_PWR (bidir), THROTTLE_1_SIG_CONN (out), THROTTLE_2_SIG_CONN (out)

### Nets
+5V_SNS: X100.9 X100.15 X100.18 X100.19
GND: C100.1 C101.1 C102.1 C103.1 C104.1 C105.2 C106.2 C107.1 C108.2 C109.2 C110.2 D100.A D101.A D102.A D103.A D104.A D105.A D106.A D107.A D108.A D109.A D110.A X100.1 X100.4 X100.5 X100.8 X100.13 X100.14 X100.17 X100.22 X100.23
IND_LIGHT_LEFT_PWR: FB100.2 ; port IND_LIGHT_LEFT_PWR
IND_LIGHT_RIGHT_PWR: FB102.2 ; port IND_LIGHT_RIGHT_PWR
IND_SWITCH_CANCEL_CONN: C101.2 D101.C X100.6 ; port IND_SWITCH_CANCEL_CONN
IND_SWITCH_LEFT_CONN: C100.2 D100.C X100.7 ; port IND_SWITCH_LEFT_CONN
IND_SWITCH_RIGHT_CONN: C102.2 D102.C X100.3 ; port IND_SWITCH_RIGHT_CONN
INDICATOR_LEFT_PWR_CONN: C103.2 D103.C FB100.1 X100.2
INDICATOR_RIGHT_PWR_CONN: C105.1 D106.C FB102.1 X100.24
LEFT_BRAKE_SIG_CONN: C104.2 D104.C X100.10 ; port LEFT_BRAKE_SIG_CONN
RIGHT_BRAKE_SIG_CONN: C106.1 D107.C X100.16 ; port RIGHT_BRAKE_SIG_CONN
SPARE_GPIO1_CONN: C107.2 D105.C X100.11 ; port SPARE_GPIO1_CONN
SPARE_OUT1_PWR: FB101.1 ; port SPARE_OUT1_PWR
SPARE_OUT1_PWR_CONN: C110.1 D110.C FB101.2 X100.12
THROTTLE_1_SIG_CONN: C108.1 D108.C X100.21 ; port THROTTLE_1_SIG_CONN
THROTTLE_2_SIG_CONN: C109.1 D109.C X100.20 ; port THROTTLE_2_SIG_CONN

### Notes on the sheet
- ID100 - FRONT CONNECTOR
- DESIGN NOTE:
- Title:
- Size:
- Date:
- A3
- Sheet       of
- Engineer:
- Version:
- Part Number:
- Revision:
- Rev. date:
- Project:
- File:

### Library data of the parts
C100-C102 C104 C106-C109 = 75: CAP CER 100PF 100V C0G 0603; Manufacturer Part Number: CGA3E2C0G2A101J080AA; Manufacturer: TDK Corporation; Obsolete Part: False; Component ID: 75; Part Value: 100p; Part Value 3: 5%; Package Type: SMT
C103 C105 C110 = 84: CAP CER 1000PF 100V X7R 0603; Manufacturer Part Number: CGA3E2X7R2A102K080AA; Manufacturer: TDK Corporation; Obsolete Part: False; Component ID: 84; Part Value: 1000p; Part Value 3: X7R; Package Type: SMT
D100-D102 D104 D105 D107-D109 = 32: 12.5V Clamp 4.8A (8/20µs) Ipp Tvs Diode Surface Mount SOD-323; Manufacturer: Nexperia USA Inc.; Part Package: SOD323; Obsolete Part: False; Component ID: 32; Part Type: TVS; Part Value: 5VWM; Package Type: SMT
D103 D106 D110 = 33: 37V Clamp 5A (8/20µs) Ipp Tvs Diode Surface Mount SOD-323; Manufacturer: Nexperia USA Inc.; Part Package: SOD323; Obsolete Part: False; Component ID: 33; Part Type: TVS; Part Value: 12VWM; Package Type: SMT
FB100-FB102 = 16: FERRITE BEAD 120 OHM 0603 1LN; Manufacturer: Murata Electronics; Obsolete Part: False; Component ID: 16; Part Value: 120 Ω/100MHz; Part Value 2: 2.0A; Package Type: SMT
X100 = 56: Connector Header Surface Mount 24 position 0.049" (1.25mm); Manufacturer: JST Sales America Inc.; Part Value: 24-Pins; Obsolete Part: False; Component ID: 56; Manufacturer Part Number: BM24B-GHDS-TF(LF)(SN); Part Pitch: 1.25mm

## Sheet LIDO-HW.100.RearConnector.SchDoc
size A3; SheetNumber: 5; SheetTotal: 17
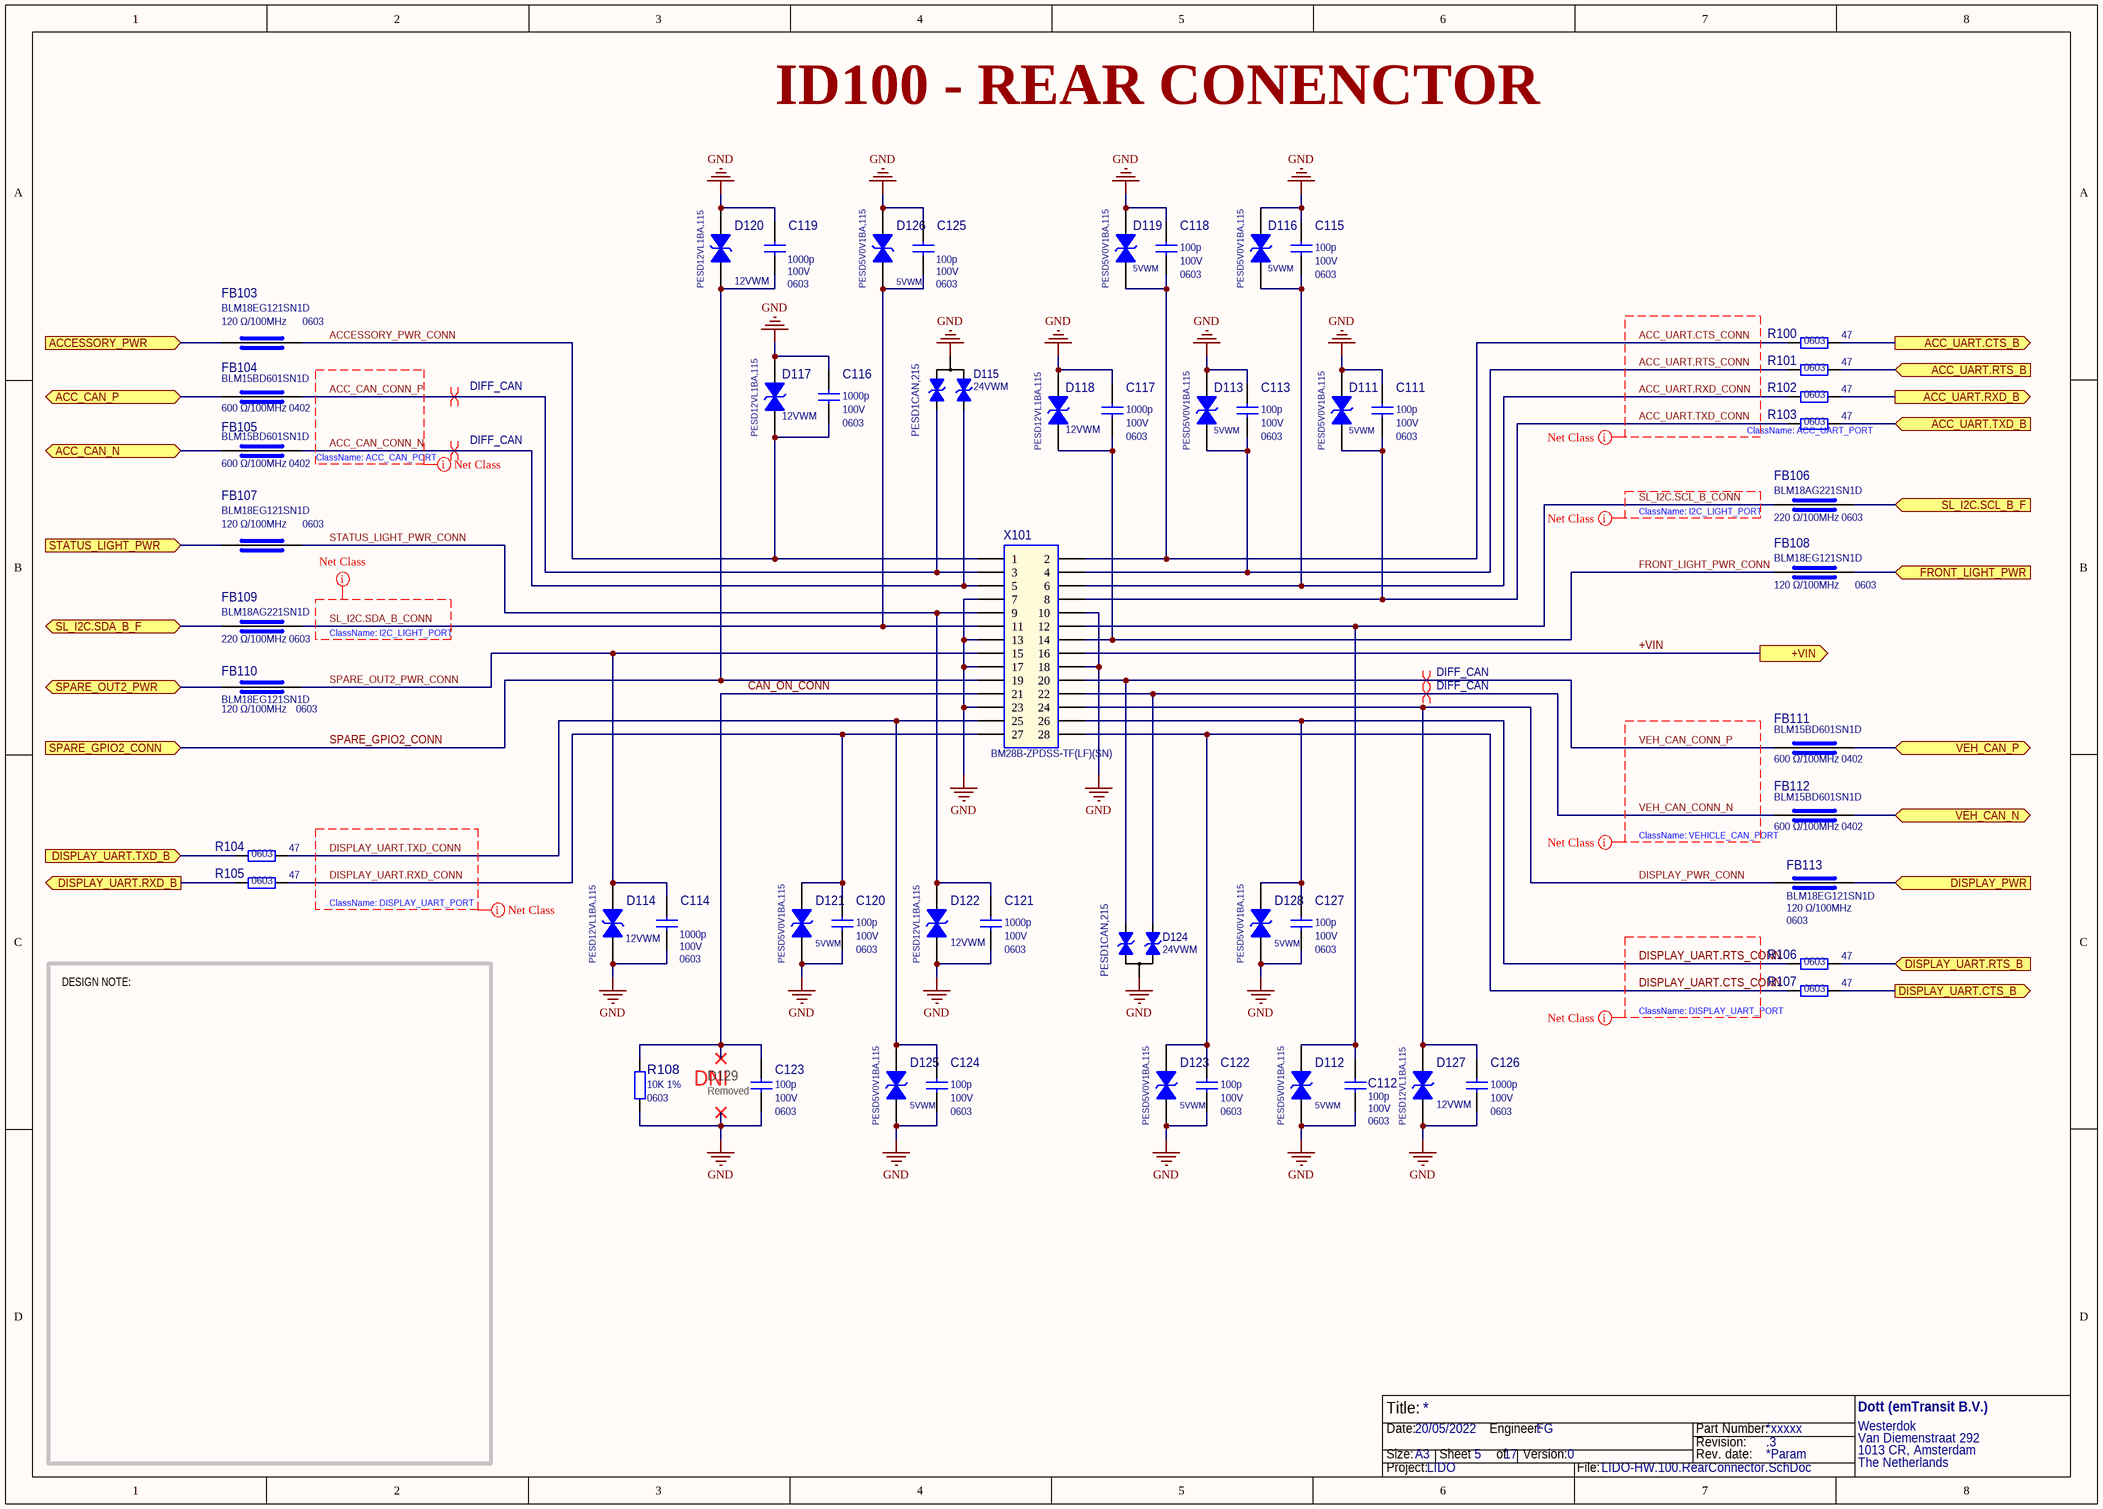
[diagram p4: LIDO-HW.100.RearConnector.SchDoc]

### Parts
C111  Part Value 2: 100V  Part Package: 0603  [CAP_0603_1608X90-N_MURATA_A]  (hidden comment: 100p)
C112  Part Value 2: 100V  Part Package: 0603  [CAP_0603_1608X90-N_MURATA_A]  (hidden comment: 100p)
C113  Part Value 2: 100V  Part Package: 0603  [CAP_0603_1608X90-N_MURATA_A]  (hidden comment: 100p)
C114  Part Value 2: 100V  Part Package: 0603  [CAP_0603_1608X90-N_MURATA_A]  (hidden comment: 1000p)
C115  Part Value 2: 100V  Part Package: 0603  [CAP_0603_1608X90-N_MURATA_A]  (hidden comment: 100p)
C116  Part Value 2: 100V  Part Package: 0603  [CAP_0603_1608X90-N_MURATA_A]  (hidden comment: 1000p)
C117  Part Value 2: 100V  Part Package: 0603  [CAP_0603_1608X90-N_MURATA_A]  (hidden comment: 1000p)
C118  Part Value 2: 100V  Part Package: 0603  [CAP_0603_1608X90-N_MURATA_A]  (hidden comment: 100p)
C119  Part Value 2: 100V  Part Package: 0603  [CAP_0603_1608X90-N_MURATA_A]  (hidden comment: 1000p)
C120  Part Value 2: 100V  Part Package: 0603  [CAP_0603_1608X90-N_MURATA_A]  (hidden comment: 100p)
C121  Part Value 2: 100V  Part Package: 0603  [CAP_0603_1608X90-N_MURATA_A]  (hidden comment: 1000p)
C122  Part Value 2: 100V  Part Package: 0603  [CAP_0603_1608X90-N_MURATA_A]  (hidden comment: 100p)
C123  Part Value 2: 100V  Part Package: 0603  [CAP_0603_1608X90-N_MURATA_A]  (hidden comment: 100p)
C124  Part Value 2: 100V  Part Package: 0603  [CAP_0603_1608X90-N_MURATA_A]  (hidden comment: 100p)
C125  Part Value 2: 100V  Part Package: 0603  [CAP_0603_1608X90-N_MURATA_A]  (hidden comment: 100p)
C126  Part Value 2: 100V  Part Package: 0603  [CAP_0603_1608X90-N_MURATA_A]  (hidden comment: 1000p)
C127  Part Value 2: 100V  Part Package: 0603  [CAP_0603_1608X90-N_MURATA_A]  (hidden comment: 100p)
D111  Manufacturer Part Number: PESD5V0V1BA,115  [NXP_SOD-323_250X125X95L30x32_A]  (hidden comment: 5VWM)
D112  Manufacturer Part Number: PESD5V0V1BA,115  [NXP_SOD-323_250X125X95L30x32_A]  (hidden comment: 5VWM)
D113  Manufacturer Part Number: PESD5V0V1BA,115  [NXP_SOD-323_250X125X95L30x32_A]  (hidden comment: 5VWM)
D114  Manufacturer Part Number: PESD12VL1BA,115  [NXP_SOD-323_250X125X95L30x32_A]  (hidden comment: 12VWM)
D115  24VWM  Manufacturer Part Number: PESD1CAN,215  [SOT23-3P95_230X100L30-N_NEXPERIA_A]
D116  Manufacturer Part Number: PESD5V0V1BA,115  [NXP_SOD-323_250X125X95L30x32_A]  (hidden comment: 5VWM)
D117  Manufacturer Part Number: PESD12VL1BA,115  [NXP_SOD-323_250X125X95L30x32_A]  (hidden comment: 12VWM)
D118  Manufacturer Part Number: PESD12VL1BA,115  [NXP_SOD-323_250X125X95L30x32_A]  (hidden comment: 12VWM)
D119  Manufacturer Part Number: PESD5V0V1BA,115  [NXP_SOD-323_250X125X95L30x32_A]  (hidden comment: 5VWM)
D120  Manufacturer Part Number: PESD12VL1BA,115  [NXP_SOD-323_250X125X95L30x32_A]  (hidden comment: 12VWM)
D121  Manufacturer Part Number: PESD5V0V1BA,115  [NXP_SOD-323_250X125X95L30x32_A]  (hidden comment: 5VWM)
D122  Manufacturer Part Number: PESD12VL1BA,115  [NXP_SOD-323_250X125X95L30x32_A]  (hidden comment: 12VWM)
D123  Manufacturer Part Number: PESD5V0V1BA,115  [NXP_SOD-323_250X125X95L30x32_A]  (hidden comment: 5VWM)
D124  24VWM  Manufacturer Part Number: PESD1CAN,215  [SOT23-3P95_230X100L30-N_NEXPERIA_A]
D125  Manufacturer Part Number: PESD5V0V1BA,115  [NXP_SOD-323_250X125X95L30x32_A]  (hidden comment: 5VWM)
D126  Manufacturer Part Number: PESD5V0V1BA,115  [NXP_SOD-323_250X125X95L30x32_A]  (hidden comment: 5VWM)
D127  Manufacturer Part Number: PESD12VL1BA,115  [NXP_SOD-323_250X125X95L30x32_A]  (hidden comment: 12VWM)
D128  Manufacturer Part Number: PESD5V0V1BA,115  [NXP_SOD-323_250X125X95L30x32_A]  (hidden comment: 5VWM)
FB103  Manufacturer Part Number: BLM18EG121SN1D  Part Package: 0603  [IND_0603_1608X95-N_AVX_A]  (hidden comment: 120 Ω/100MHz)
FB104  Manufacturer Part Number: BLM15BD601SN1D  Part Package: 0402  [IND_0402_1005X60-N_AVX_A]  (hidden comment: 600 Ω/100MHz)
FB105  Manufacturer Part Number: BLM15BD601SN1D  Part Package: 0402  [IND_0402_1005X60-N_AVX_A]  (hidden comment: 600 Ω/100MHz)
FB106  Manufacturer Part Number: BLM18AG221SN1D  Part Package: 0603  [IND_0603_1608X95-N_AVX_A]  (hidden comment: 220 Ω/100MHz)
FB107  Manufacturer Part Number: BLM18EG121SN1D  Part Package: 0603  [IND_0603_1608X95-N_AVX_A]  (hidden comment: 120 Ω/100MHz)
FB108  Manufacturer Part Number: BLM18EG121SN1D  Part Package: 0603  [IND_0603_1608X95-N_AVX_A]  (hidden comment: 120 Ω/100MHz)
FB109  Manufacturer Part Number: BLM18AG221SN1D  Part Package: 0603  [IND_0603_1608X95-N_AVX_A]  (hidden comment: 220 Ω/100MHz)
FB110  Manufacturer Part Number: BLM18EG121SN1D  Part Package: 0603  [IND_0603_1608X95-N_AVX_A]  (hidden comment: 120 Ω/100MHz)
FB111  Manufacturer Part Number: BLM15BD601SN1D  Part Package: 0402  [IND_0402_1005X60-N_AVX_A]  (hidden comment: 600 Ω/100MHz)
FB112  Manufacturer Part Number: BLM15BD601SN1D  Part Package: 0402  [IND_0402_1005X60-N_AVX_A]  (hidden comment: 600 Ω/100MHz)
FB113  Manufacturer Part Number: BLM18EG121SN1D  Part Package: 0603  [IND_0603_1608X95-N_AVX_A]  (hidden comment: 120 Ω/100MHz)
R100  47  Part Package: 0603  [RES_0603_1608X60-N_YAGEO_A]
R101  47  Part Package: 0603  [RES_0603_1608X60-N_YAGEO_A]
R102  47  Part Package: 0603  [RES_0603_1608X60-N_YAGEO_A]
R103  47  Part Package: 0603  [RES_0603_1608X60-N_YAGEO_A]
R104  47  Part Package: 0603  [RES_0603_1608X60-N_YAGEO_A]
R105  47  Part Package: 0603  [RES_0603_1608X60-N_YAGEO_A]
R106  47  Part Package: 0603  [RES_0603_1608X60-N_YAGEO_A]
R107  47  Part Package: 0603  [RES_0603_1608X60-N_YAGEO_A]
R108  Part Value 2: 1%  Part Package: 0603  [RES_0603_1608X60-N_YAGEO_A]  (hidden comment: 10K)
X101  BM28B-ZPDSS-TF(LF)(SN)  [JST_BM28B-ZPDSS-TF_A]

### Ports
+VIN (out), ACC_CAN_N (bidir), ACC_CAN_P (bidir), ACC_UART.CTS_B (out), ACC_UART.RTS_B (in), ACC_UART.RXD_B (out), ACC_UART.TXD_B (in), ACCESSORY_PWR (in), DISPLAY_PWR (in), DISPLAY_UART.CTS_B (out), DISPLAY_UART.RTS_B (in), DISPLAY_UART.RXD_B (out), DISPLAY_UART.TXD_B (in), FRONT_LIGHT_PWR (in), SL_I2C.SCL_B_F (in), SL_I2C.SDA_B_F (bidir), SPARE_GPIO2_CONN (in), SPARE_OUT2_PWR (bidir), STATUS_LIGHT_PWR (in), VEH_CAN_N (bidir), VEH_CAN_P (bidir)

### Nets
GND: C111.1 C112.1 C113.1 C114.1 C115.1 C116.1 C117.1 C118.1 C119.2 C120.2 C121.2 C122.2 C123.2 C124.2 C125.2 C126.2 C127.2 D111.A D112.A D113.A D114.A D115.3 D116.A D117.A D118.A D119.A D120.A D121.A D122.A D123.A D124.3 D125.A D126.A D127.A D128.A R108.1 X101.7 X101.10 X101.13 X101.17 X101.18 X101.23
+VIN: X101.16 ; port +VIN
ACC_CAN_CONN_N: D115.1 FB105.2 X101.5
ACC_CAN_CONN_P: D115.2 FB104.2 X101.3
ACC_CAN_N: FB105.1 ; port ACC_CAN_N
ACC_CAN_P: FB104.1 ; port ACC_CAN_P
ACC_UART.CTS_B: R100.2 ; port ACC_UART.CTS_B
ACC_UART.CTS_CONN: C118.2 D119.C R100.1 X101.2
ACC_UART.RTS_B: R101.2 ; port ACC_UART.RTS_B
ACC_UART.RTS_CONN: C113.2 D113.C R101.1 X101.4
ACC_UART.RXD_B: R102.2 ; port ACC_UART.RXD_B
ACC_UART.RXD_CONN: C115.2 D116.C R102.1 X101.6
ACC_UART.TXD_B: R103.2 ; port ACC_UART.TXD_B
ACC_UART.TXD_CONN: C111.2 D111.C R103.1 X101.8
ACCESSORY_PWR: FB103.1 ; port ACCESSORY_PWR
ACCESSORY_PWR_CONN: C116.2 D117.C FB103.2 X101.1
CAN_ON_CONN: C123.1 R108.2 X101.21
DISPLAY_PWR: FB113.2 ; port DISPLAY_PWR
DISPLAY_PWR_CONN: C126.1 D127.C FB113.1 X101.24
DISPLAY_UART.CTS_B: R107.2 ; port DISPLAY_UART.CTS_B
DISPLAY_UART.CTS_CONN: C122.1 D123.C R107.1 X101.28
DISPLAY_UART.RTS_B: R106.2 ; port DISPLAY_UART.RTS_B
DISPLAY_UART.RTS_CONN: C127.1 D128.C R106.1 X101.26
DISPLAY_UART.RXD_B: R105.1 ; port DISPLAY_UART.RXD_B
DISPLAY_UART.RXD_CONN: C120.1 D121.C R105.2 X101.27
DISPLAY_UART.TXD_B: R104.1 ; port DISPLAY_UART.TXD_B
DISPLAY_UART.TXD_CONN: C124.1 D125.C R104.2 X101.25
FRONT_LIGHT_PWR: FB108.2 ; port FRONT_LIGHT_PWR
FRONT_LIGHT_PWR_CONN: C117.2 D118.C FB108.1 X101.14
SL_I2C.SCL_B_CONN: C112.2 D112.C FB106.1 X101.12
SL_I2C.SCL_B_F: FB106.2 ; port SL_I2C.SCL_B_F
SL_I2C.SDA_B_CONN: C125.1 D126.C FB109.2 X101.11
SL_I2C.SDA_B_F: FB109.1 ; port SL_I2C.SDA_B_F
SPARE_GPIO2_CONN: C119.1 D120.C X101.19 ; port SPARE_GPIO2_CONN
SPARE_OUT2_PWR: FB110.1 ; port SPARE_OUT2_PWR
SPARE_OUT2_PWR_CONN: C114.2 D114.C FB110.2 X101.15
STATUS_LIGHT_PWR: FB107.1 ; port STATUS_LIGHT_PWR
STATUS_LIGHT_PWR_CONN: C121.1 D122.C FB107.2 X101.9
VEH_CAN_CONN_N: D124.2 FB112.1 X101.22
VEH_CAN_CONN_P: D124.1 FB111.1 X101.20
VEH_CAN_N: FB112.2 ; port VEH_CAN_N
VEH_CAN_P: FB111.2 ; port VEH_CAN_P

### Layout directives
net class ACC_CAN_PORT: ACC_CAN_CONN_N, ACC_CAN_CONN_P
net class I2C1_LIGHT_PORT: SL_I2C.SCL_B_CONN, SL_I2C.SDA_B_CONN
net class VEHICLE_CAN_PORT: VEH_CAN_CONN_N, VEH_CAN_CONN_P
differential pair; differential pair class DIFF_CAN: ACC_CAN_CONN_N, ACC_CAN_CONN_P, VEH_CAN_CONN_N, VEH_CAN_CONN_P
net class DISPLAY_UART_PORT: DISPLAY_UART.CTS_CONN, DISPLAY_UART.RTS_CONN, DISPLAY_UART.RXD_CONN, DISPLAY_UART.TXD_CONN
net class ACC_UART_PORT: ACC_UART.CTS_CONN, ACC_UART.RTS_CONN, ACC_UART.RXD_CONN, ACC_UART.TXD_CONN

### Notes on the sheet
- ID100 - REAR CONENCTOR
- ClassName: ACC_UART_PORT
- (near FB105) ClassName: ACC_CAN_PORT
- (near FB106) ClassName: I2C_LIGHT_PORT
- ClassName: I2C_LIGHT_PORT
- (near FB112) ClassName: VEHICLE_CAN_PORT
- ClassName: DISPLAY_UART_PORT
- DESIGN NOTE:
- (near R107) ClassName: DISPLAY_UART_PORT
- (near C123) D129
- (near C123) Removed
- Title:
- Size:
- Date:
- A3
- Sheet       of
- Engineer:
- Version:
- Part Number:
- Revision:
- Rev. date:
- Project:
- File:

### Library data of the parts
C111-C113 C115 C118 C120 C122-C125 C127 = 75: as C100 on sheet LIDO-HW.100.FrontConnector; Part Value: 100p; Part Value 3: 5%; Package Type: SMT
C114 C116 C117 C119 C121 C126 = 84: as C103 on sheet LIDO-HW.100.FrontConnector; Part Value: 1000p; Part Value 3: X7R; Package Type: SMT
D111-D113 D116 D119 D121 D123 D125 D126 D128 = 32: as D100 on sheet LIDO-HW.100.FrontConnector; Part Type: TVS; Part Value: 5VWM; Package Type: SMT
D114 D117 D118 D120 D122 D127 = 33: as D103 on sheet LIDO-HW.100.FrontConnector; Part Type: TVS; Part Value: 12VWM; Package Type: SMT
D115 D124 = 34: 70V Clamp 3A (8/20µs) Ipp Tvs Diode Surface Mount TO-236AB; Manufacturer: Nexperia USA Inc.; Part Package: SOT23-3; Obsolete Part: False; Component ID: 34; Part Type: TVS; Part Value: 24VWM; Package Type: SMT
FB103 FB107 FB108 FB110 FB113 = 16: as FB100 on sheet LIDO-HW.100.FrontConnector; Part Value: 120 Ω/100MHz; Part Value 2: 2.0A; Package Type: SMT
FB104 FB105 FB111 FB112 = 18: FERRITE BEAD 600 OHM 0402 1LN; Manufacturer: Murata Electronics; Obsolete Part: False; Component ID: 18; Part Value: 600 Ω/100MHz; Part Value 2: 200mA; Package Type: SMT
FB106 FB109 = 17: FERRITE BEAD 220 OHM 0603 1LN; Manufacturer: Murata Electronics; Obsolete Part: False; Component ID: 17; Part Value: 220 Ω/100MHz; Part Value 2: 500mA; Package Type: SMT
R100-R107 = 120: RES SMD 47 OHM 5% 1/4W 0603; Manufacturer Part Number: ERJ-PA3J470V; Manufacturer: Panasonic Electronic Components; Obsolete Part: False; Component ID: 120; Part Value: 47; Part Value 2: 5%; Part Value 3: 1/4W; Package Type: SMT
R108 = 115: RES 10K OHM 1% 1/10W 0603; Manufacturer Part Number: RC0603FR-0710KL; Manufacturer: YAGEO; Obsolete Part: False; Component ID: 115; Part Value: 10K; Part Value 3: 1/10W; Package Type: SMT
X101 = 55: Connector Header Surface Mount 28 position 0.059" (1.50mm); Manufacturer: JST Sales America Inc.; Part Value: 28-Pins; Obsolete Part: False; Component ID: 55; Manufacturer Part Number: BM28B-ZPDSS-TF(LF)(SN); Part Pitch: 1.50mm

## Sheet LIDO-HW.100.VinAndPower.SchDoc
size A3; SheetNumber: 6; SheetTotal: 17
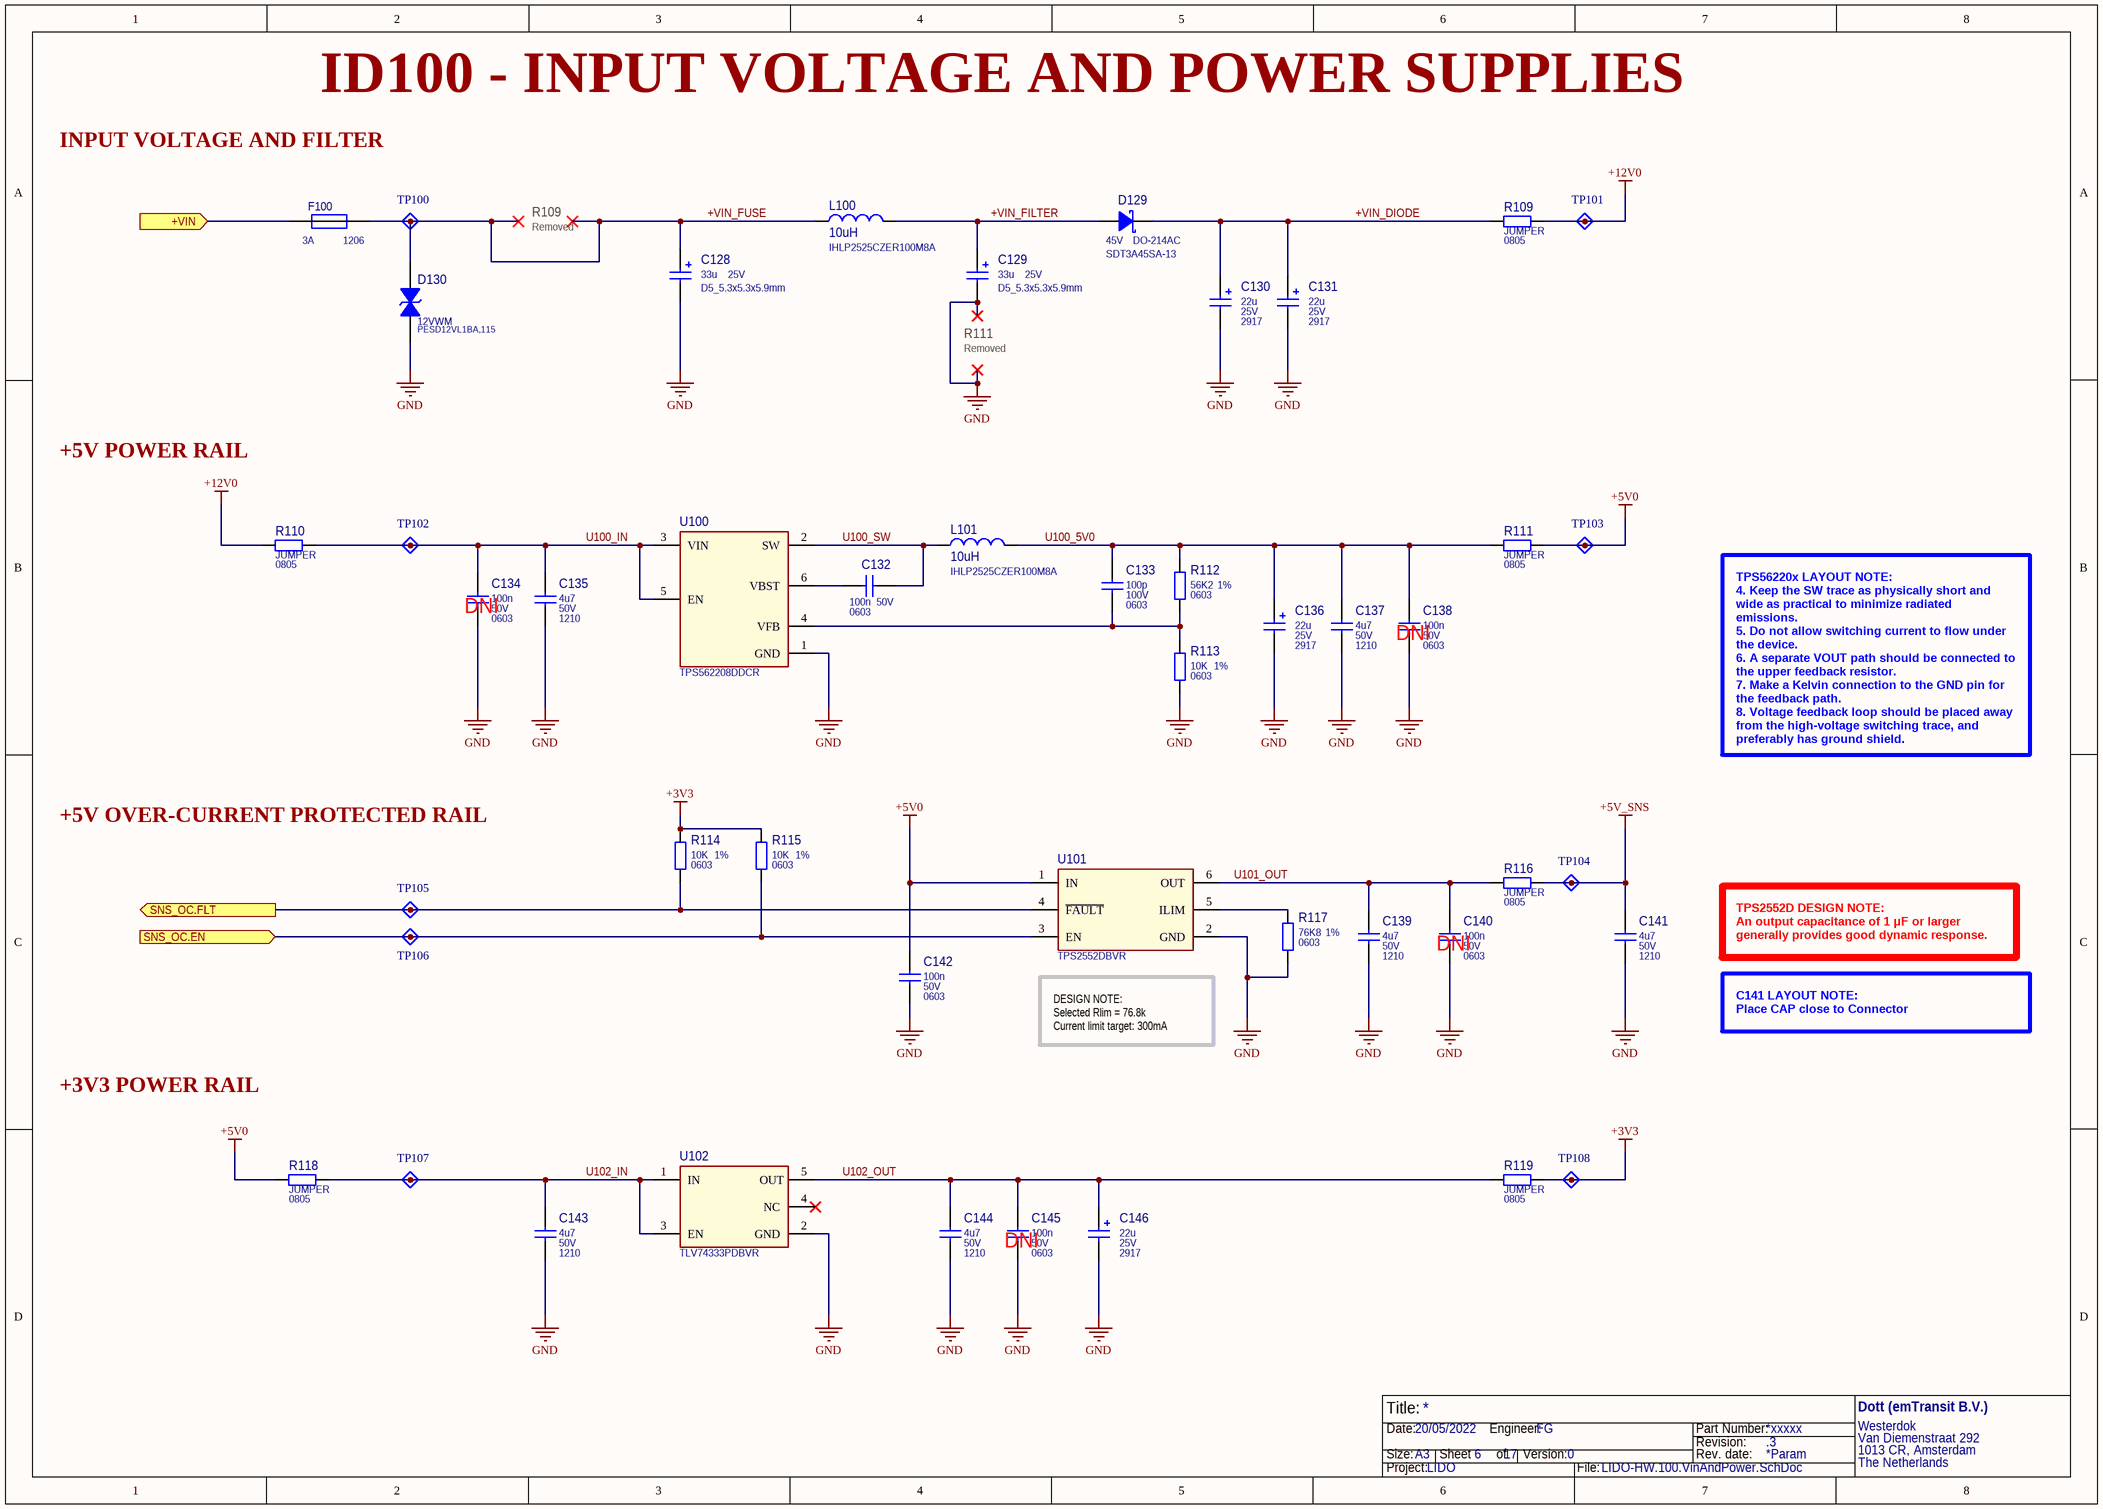
[diagram p5: LIDO-HW.100.VinAndPower.SchDoc]

### Parts
C128  33u  Part Value 2: 25V  Part Package: D5_5.3x5.3x5.9mm  [CAPAE_C_530X590L22X7-N_PANASONIC_A]
C129  33u  Part Value 2: 25V  Part Package: D5_5.3x5.3x5.9mm  [CAPAE_C_530X590L22X7-N_PANASONIC_A]
C130  22u  Part Value 2: 25V  Part Package: 2917  [CAP_2917_7343X140-N_MURATA_A]
C131  22u  Part Value 2: 25V  Part Package: 2917  [CAP_2917_7343X140-N_MURATA_A]
C132  100n  Part Value 2: 50V  Part Package: 0603  [CAP_0603_1608X90-N_MURATA_A]
C133  100p  Part Value 2: 100V  Part Package: 0603  [CAP_0603_1608X90-N_MURATA_A]
C134  100n  Part Value 2: 50V  Part Package: 0603  [CAP_0603_1608X90-N_MURATA_A]
C135  4u7  Part Value 2: 50V  Part Package: 1210  [CAP_1210_3225X180-N_MURATA_A]
C136  22u  Part Value 2: 25V  Part Package: 2917  [CAP_2917_7343X140-N_MURATA_A]
C137  4u7  Part Value 2: 50V  Part Package: 1210  [CAP_1210_3225X180-N_MURATA_A]
C138  100n  Part Value 2: 50V  Part Package: 0603  [CAP_0603_1608X90-N_MURATA_A]
C139  4u7  Part Value 2: 50V  Part Package: 1210  [CAP_1210_3225X180-N_MURATA_A]
C140  100n  Part Value 2: 50V  Part Package: 0603  [CAP_0603_1608X90-N_MURATA_A]
C141  4u7  Part Value 2: 50V  Part Package: 1210  [CAP_1210_3225X180-N_MURATA_A]
C142  100n  Part Value 2: 50V  Part Package: 0603  [CAP_0603_1608X90-N_MURATA_A]
C143  4u7  Part Value 2: 50V  Part Package: 1210  [CAP_1210_3225X180-N_MURATA_A]
C144  4u7  Part Value 2: 50V  Part Package: 1210  [CAP_1210_3225X180-N_MURATA_A]
C145  100n  Part Value 2: 50V  Part Package: 0603  [CAP_0603_1608X90-N_MURATA_A]
C146  22u  Part Value 2: 25V  Part Package: 2917  [CAP_2917_7343X140-N_MURATA_A]
D129  45V  Manufacturer Part Number: SDT3A45SA-13  Part Package: DO-214AC  [DIOM519X260X240L114X145-N_WURTH_A]
D130  Manufacturer Part Number: PESD12VL1BA,115  [NXP_SOD-323_250X125X95L30x32_A]  (hidden comment: 12VWM)
F100  3A  Part Package: 1206  [FUSE_1206-N_YAGEO_A]
L100  10uH  Manufacturer Part Number: IHLP2525CZER100M8A  [VISHAY_IHLP2525CZ_647X647X300_A]
L101  10uH  Manufacturer Part Number: IHLP2525CZER100M8A  [VISHAY_IHLP2525CZ_647X647X300_A]
R109  JUMPER  Part Package: 0805  [RES_0805_2012X65-N_YAGEO_A]
R110  JUMPER  Part Package: 0805  [RES_0805_2012X65-N_YAGEO_A]
R111  JUMPER  Part Package: 0805  [RES_0805_2012X65-N_YAGEO_A]
R112  56K2  Part Value 2: 1%  Part Package: 0603  [RES_0603_1608X60-N_YAGEO_A]
R113  10K  Part Value 2: 1%  Part Package: 0603  [RES_0603_1608X60-N_YAGEO_A]
R114  10K  Part Value 2: 1%  Part Package: 0603  [RES_0603_1608X60-N_YAGEO_A]
R115  10K  Part Value 2: 1%  Part Package: 0603  [RES_0603_1608X60-N_YAGEO_A]
R116  JUMPER  Part Package: 0805  [RES_0805_2012X65-N_YAGEO_A]
R117  76K8  Part Value 2: 1%  Part Package: 0603  [RES_0603_1608X60-N_YAGEO_A]
R118  JUMPER  Part Package: 0805  [RES_0805_2012X65-N_YAGEO_A]
R119  JUMPER  Part Package: 0805  [RES_0805_2012X65-N_YAGEO_A]
TP100  TestPoint_A  [TESTPOINT_1D_A]  (value not drawn)  (no BOM)
TP101  TestPoint_A  [TESTPOINT_1D_A]  (value not drawn)  (no BOM)
TP102  TestPoint_A  [TESTPOINT_1D_A]  (value not drawn)  (no BOM)
TP103  TestPoint_A  [TESTPOINT_1D_A]  (value not drawn)  (no BOM)
TP104  TestPoint_A  [TESTPOINT_1D_A]  (value not drawn)  (no BOM)
TP105  TestPoint_A  [TESTPOINT_1D_A]  (value not drawn)  (no BOM)
TP106  TestPoint_A  [TESTPOINT_1D_A]  (value not drawn)  (no BOM)
TP107  TestPoint_A  [TESTPOINT_1D_A]  (value not drawn)  (no BOM)
TP108  TestPoint_A  [TESTPOINT_1D_A]  (value not drawn)  (no BOM)
U100  TPS562208DDCR  [SOT23-6P95_280X145L45-N_MICROCHIP_A]
U101  TPS2552DBVR  [SOT23-6P95_280X145L45-N_MICROCHIP_A]
U102  TLV74333PDBVR  [SOT23-5P95_280X145L45-N_TI_A]

### Ports
+VIN (in), SNS_OC.EN (in), SNS_OC.FLT (out)

### Nets
+3V3: R114.2 R115.2 R119.2 TP108.1(TP)
+5V0: C142.2 R111.2 R118.1 TP103.1(TP) U101.1(IN)
+5V_SNS: C141.1 R116.2 TP104.1(TP)
+12V0: R109.2 R110.1 TP101.1(TP)
GND: C128.2 C129.2 C130.2 C131.2 C134.1 C135.2 C136.2 C137.2 C138.1 C139.2 C140.1 C141.2 C142.1 C143.2 C144.2 C145.1 C146.2 D130.C R113.1 R117.1 U100.1(GND) U101.2(GND) U102.2(GND)
+VIN: F100.1 ; port +VIN
+VIN_DIODE: C130.1 C131.1 D129.C R109.1
+VIN_FILTER: C129.1 D129.A L100.2
+VIN_FUSE: C128.1 D130.A F100.2 L100.1 TP100.1(TP)
SNS_OC.EN: R115.1 TP106.1(TP) U101.3(EN) ; port SNS_OC.EN
SNS_OC.FLT: R114.1 TP105.1(TP) U101.4(~{FAULT}) ; port SNS_OC.FLT
U100_5V0: C133.1 C136.1 C137.1 C138.2 L101.2 R111.1 R112.2
U100_IN: C134.2 C135.1 R110.2 TP102.1(TP) U100.3(VIN) U100.5(EN)
U100_SW: C132.2 L101.1 U100.2(SW)
U101_OUT: C139.1 C140.2 R116.1 U101.6(OUT)
U102_IN: C143.1 R118.2 TP107.1(TP) U102.1(IN) U102.3(EN)
U102_OUT: C144.1 C145.2 C146.1 R119.1 U102.5(OUT)
NetC132_1: C132.1 U100.6(VBST)
NetC133_2: C133.2 R112.1 R113.2 U100.4(VFB)
NetR117_2: R117.2 U101.5(ILIM)

Not connected (* = marked no-connect by the designer): U102 4(NC)*

### Notes on the sheet
- ID100 - INPUT VOLTAGE AND POWER SUPPLIES
- INPUT VOLTAGE AND FILTER
- Removed
- R109
- (near C129) R111
- +5V POWER RAIL
- TPS56220x LAYOUT NOTE:
  4. Keep the SW trace as physically short and wide as practical to minimize radiated emissions.
  5. Do not allow switching current to flow under the device.
  6. A separate VOUT path should be connected to the upper feedback resistor.
  7. Make a Kelvin connection to the GND pin for the feedback path.
  8. Voltage feedback loop should be placed away from the high-voltage switching trace, and preferably has ground shield.
- +5V OVER-CURRENT PROTECTED RAIL
- TPS2552D DESIGN NOTE:
  An output capacitance of 1 μF or larger generally provides good dynamic response.
- DESIGN NOTE:
  Selected Rlim = 76.8k
  Current limit target: 300mA
- C141 LAYOUT NOTE:
  Place CAP close to Connector
- +3V3 POWER RAIL
- Title:
- Size:
- Date:
- A3
- Sheet       of
- Engineer:
- Version:
- Part Number:
- Revision:
- Rev. date:
- Project:
- File:

### Library data of the parts
C128 C129 = 86: CAP ALUM POLY 33UF 20% 25V SMD; Manufacturer Part Number: 25SVPK33M; Manufacturer: Panasonic Electronic Components; Obsolete Part: False; Component ID: 86; Part Value: 33u; Part Value 3: 20%; Package Type: SMT
C130 C131 C136 C146 = 87: CAP ALUM POLY 22UF 20% 25V SMD; Manufacturer Part Number: ECASD31E226M040KA0; Manufacturer: Murata Electronics; Obsolete Part: False; Component ID: 87; Part Value: 22u; Part Value 3: 20%; Package Type: SMT
C132 C134 C138 C140 C142 C145 = 77: CAP CER 0.1UF 50V X7R 0603; Manufacturer Part Number: CGA3E2X7R1H104K080AA; Manufacturer: TDK Corporation; Obsolete Part: False; Component ID: 77; Part Value: 100n; Part Value 3: X7R; Package Type: SMT
C133 = 75: as C100 on sheet LIDO-HW.100.FrontConnector; Part Value: 100p; Part Value 3: 5%; Package Type: SMT
C135 C137 C139 C141 C143 C144 = 91: CAP CER 4.7UF 50V X7R 1210; Manufacturer Part Number: CL32B475KBJVPNE; Manufacturer: Samsung Electro-Mechanics; Obsolete Part: False; Component ID: 91; Part Value: 4u7; Part Value 3: X7R; Package Type: SMT
D129 = 16: SCHOTTKY RECTIFIER SMA T&R 10K; Manufacturer: Diodes Incorporated; Obsolete Part: False; Component ID: 16; Part Value: 45V; Part Value 2: 3A; Package Type: SMT
D130 = 33: as D103 on sheet LIDO-HW.100.FrontConnector; Part Type: TVS; Part Value: 12VWM; Package Type: SMT
F100 = 35: 3 A 125 V AC 63 V DC Fuse Board Mount (Cartridge Style Excluded) Surface Mount 1206 (3216 Metric); Manufacturer Part Number: C1Q 3; Manufacturer: Bel Fuse Inc.; Obsolete Part: False; Component ID: 35; Part Type: FUSE; Part Value: 3A; Package Type: SMT
L100 L101 = 25: FIXED IND 10UH 4A 76.9 MOHM SMD; Manufacturer: Vishay Dale; Part Package: 6.47x6.47x3.0mm; Obsolete Part: False; Component ID: 25; Part Value: 10uH; Part Value 2: 20%; Part Value 3: 4A; Package Type: SMT
R109-R111 R116 R118 R119 = 97: RES SMD 0 OHM JUMPER 1/8W 0805; Manufacturer Part Number: ERJ-6GEY0R00V; Manufacturer: Panasonic Electronic Components; Obsolete Part: False; Component ID: 97; Part Value: JUMPER; Part Value 2: %; Part Value 3: 1/8W; Package Type: SMT
R112 = 101: RES SMD 56.2K OHM 1% 1/10W 0603; Manufacturer Part Number: ERJ-3EKF5622V; Manufacturer: Panasonic Electronic Components; Obsolete Part: False; Component ID: 101; Part Value: 56K2; Part Value 3: 1/10W; Package Type: SMT
R113-R115 = 115: as R108 on sheet LIDO-HW.100.RearConnector; Part Value: 10K; Part Value 3: 1/10W; Package Type: SMT
R117 = 102: RES SMD 76.8K OHM 1% 1/10W 0603; Manufacturer Part Number: ERJ-3EKF7682V; Manufacturer: Panasonic Electronic Components; Manufacturer Part Number 2nd: RMCF0603FT76K8; Manufacturer 2nd: Stackpole Electronics Inc; Obsolete Part: False; Component ID: 102; Part Value: 76K8; Part Value 3: 1/10W; Package Type: SMT
TP100-TP108 = 3: Pad Diamater 1mm; Part: Test Point 1D A; Obsolete Part: False; 00_Name: TP_XXmm; Component ID: 3; 02_Layer: *; 01_Diameter: 1mm
U100 = 32: Buck Switching Regulator IC Positive Adjustable 0.768V 1 Output 2A SOT-23-6 Thin, TSOT-23-6; Manufacturer: Texas Instruments; Part Package: SOT23-6; Obsolete Part: False; Component ID: 32; Manufacturer Part Number: TPS562208DDCR; Part Type: Buck; Part Value: TPS562208; Package Type: SMT
U101 = 33: Power Switch/Driver 1:1 N-Channel 1.5A SOT-23-6; Manufacturer: Texas Instruments; Part Package: SOT23-6; Obsolete Part: False; Component ID: 33; Manufacturer Part Number: TPS2552DBVR; Part Type: Power Switch; Part Value: TPS2552D; Package Type: SMT
U102 = 34: Linear Voltage Regulator IC Positive Fixed 1 Output 300mA SOT-23-5; Manufacturer: Texas Instruments; Part Package: SOT23-5; Obsolete Part: False; Component ID: 34; Manufacturer Part Number: TLV74333PDBVR; Part Type: LDO 5V 50mA; Part Value: TLV74333PD; Package Type: SMT

## Sheet LIDO-HW.100.InputStage_1.SchDoc
size A3; SheetNumber: 7; SheetTotal: 17
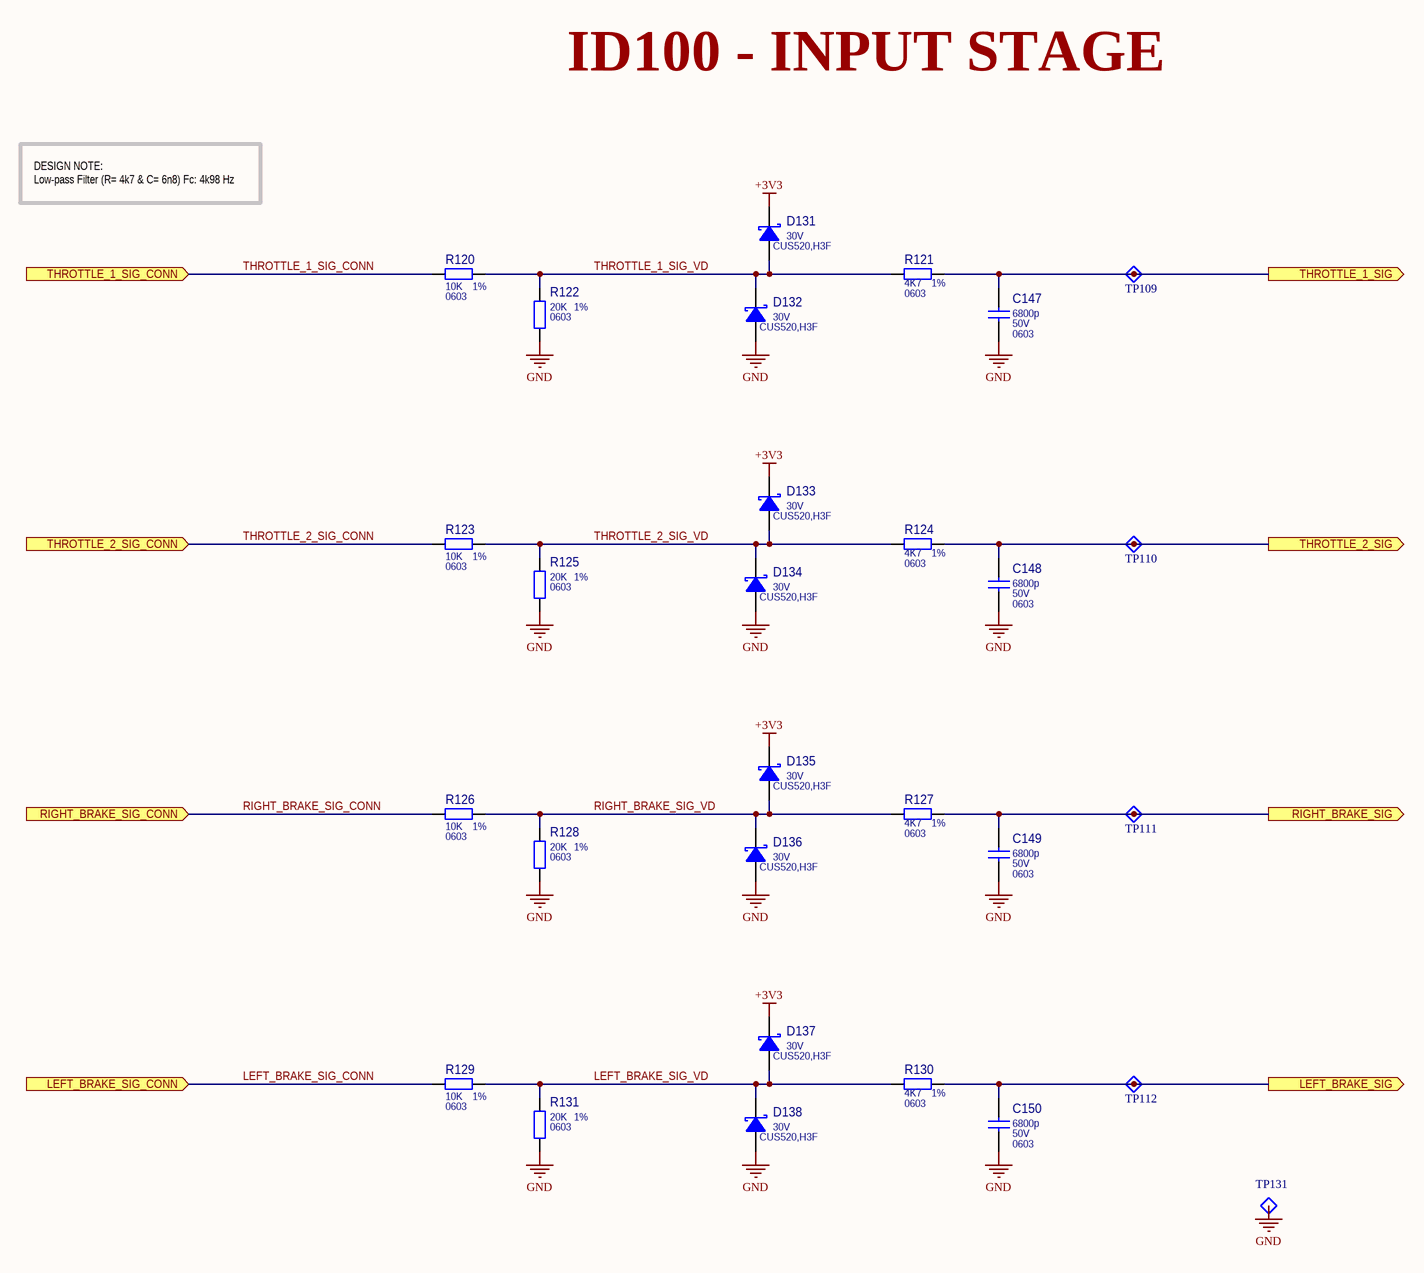
[diagram p6: LIDO-HW.100.InputStage_1.SchDoc]

### Parts
C147  6800p  Part Value 2: 50V  Part Package: 0603  [CAP_0603_1608X90-N_MURATA_A]
C148  6800p  Part Value 2: 50V  Part Package: 0603  [CAP_0603_1608X90-N_MURATA_A]
C149  6800p  Part Value 2: 50V  Part Package: 0603  [CAP_0603_1608X90-N_MURATA_A]
C150  6800p  Part Value 2: 50V  Part Package: 0603  [CAP_0603_1608X90-N_MURATA_A]
D131  30V  Manufacturer Part Number: CUS520,H3F  [NXP_SOD-323_250X125X95L30x32_A]
D132  30V  Manufacturer Part Number: CUS520,H3F  [NXP_SOD-323_250X125X95L30x32_A]
D133  30V  Manufacturer Part Number: CUS520,H3F  [NXP_SOD-323_250X125X95L30x32_A]
D134  30V  Manufacturer Part Number: CUS520,H3F  [NXP_SOD-323_250X125X95L30x32_A]
D135  30V  Manufacturer Part Number: CUS520,H3F  [NXP_SOD-323_250X125X95L30x32_A]
D136  30V  Manufacturer Part Number: CUS520,H3F  [NXP_SOD-323_250X125X95L30x32_A]
D137  30V  Manufacturer Part Number: CUS520,H3F  [NXP_SOD-323_250X125X95L30x32_A]
D138  30V  Manufacturer Part Number: CUS520,H3F  [NXP_SOD-323_250X125X95L30x32_A]
R120  10K  Part Value 2: 1%  Part Package: 0603  [RES_0603_1608X60-N_YAGEO_A]
R121  4K7  Part Value 2: 1%  Part Package: 0603  [RES_0603_1608X60-N_YAGEO_A]
R122  20K  Part Value 2: 1%  Part Package: 0603  [RES_0603_1608X60-N_YAGEO_A]
R123  10K  Part Value 2: 1%  Part Package: 0603  [RES_0603_1608X60-N_YAGEO_A]
R124  4K7  Part Value 2: 1%  Part Package: 0603  [RES_0603_1608X60-N_YAGEO_A]
R125  20K  Part Value 2: 1%  Part Package: 0603  [RES_0603_1608X60-N_YAGEO_A]
R126  10K  Part Value 2: 1%  Part Package: 0603  [RES_0603_1608X60-N_YAGEO_A]
R127  4K7  Part Value 2: 1%  Part Package: 0603  [RES_0603_1608X60-N_YAGEO_A]
R128  20K  Part Value 2: 1%  Part Package: 0603  [RES_0603_1608X60-N_YAGEO_A]
R129  10K  Part Value 2: 1%  Part Package: 0603  [RES_0603_1608X60-N_YAGEO_A]
R130  4K7  Part Value 2: 1%  Part Package: 0603  [RES_0603_1608X60-N_YAGEO_A]
R131  20K  Part Value 2: 1%  Part Package: 0603  [RES_0603_1608X60-N_YAGEO_A]
TP109  TestPoint_A  [TESTPOINT_1D_A]  (value not drawn)  (no BOM)
TP110  TestPoint_A  [TESTPOINT_1D_A]  (value not drawn)  (no BOM)
TP111  TestPoint_A  [TESTPOINT_1D_A]  (value not drawn)  (no BOM)
TP112  TestPoint_A  [TESTPOINT_1D_A]  (value not drawn)  (no BOM)
TP131  TestPoint_A  [TESTPOINT_1D_A]  (value not drawn)  (no BOM)

### Ports
LEFT_BRAKE_SIG (out), LEFT_BRAKE_SIG_CONN (in), RIGHT_BRAKE_SIG (out), RIGHT_BRAKE_SIG_CONN (in), THROTTLE_1_SIG (out), THROTTLE_1_SIG_CONN (in), THROTTLE_2_SIG (out), THROTTLE_2_SIG_CONN (in)

### Nets
+3V3: D131.C D133.C D135.C D137.C
GND: C147.2 C148.2 C149.2 C150.2 D132.A D134.A D136.A D138.A R122.1 R125.1 R128.1 R131.1 TP131.1(TP)
LEFT_BRAKE_SIG: C150.1 R130.2 TP112.1(TP) ; port LEFT_BRAKE_SIG
LEFT_BRAKE_SIG_CONN: R129.2 ; port LEFT_BRAKE_SIG_CONN
LEFT_BRAKE_SIG_VD: D137.A D138.C R129.1 R130.1 R131.2
RIGHT_BRAKE_SIG: C149.1 R127.2 TP111.1(TP) ; port RIGHT_BRAKE_SIG
RIGHT_BRAKE_SIG_CONN: R126.2 ; port RIGHT_BRAKE_SIG_CONN
RIGHT_BRAKE_SIG_VD: D135.A D136.C R126.1 R127.1 R128.2
THROTTLE_1_SIG: C147.1 R121.2 TP109.1(TP) ; port THROTTLE_1_SIG
THROTTLE_1_SIG_CONN: R120.2 ; port THROTTLE_1_SIG_CONN
THROTTLE_1_SIG_VD: D131.A D132.C R120.1 R121.1 R122.2
THROTTLE_2_SIG: C148.1 R124.2 TP110.1(TP) ; port THROTTLE_2_SIG
THROTTLE_2_SIG_CONN: R123.2 ; port THROTTLE_2_SIG_CONN
THROTTLE_2_SIG_VD: D133.A D134.C R123.1 R124.1 R125.2

### Notes on the sheet
- ID100 - INPUT STAGE
- DESIGN NOTE:
  Low-pass Filter (R= 4k7 & C= 6n8) Fc: 4k98 Hz
- Title:
- Size:
- Date:
- A3
- Sheet       of
- Engineer:
- Version:
- Part Number:
- Revision:
- Rev. date:
- Project:
- File:

### Library data of the parts
C147-C150 = 79: CAP CER 6800PF 50V X7R 0603; Manufacturer Part Number: CGA3E2X7R1H682K080AA; Manufacturer: TDK Corporation; Obsolete Part: False; Component ID: 79; Part Value: 6800p; Part Value 3: X7R; Package Type: SMT
D131-D138 = 17: DIODE SCHOTTKY 30V 200MA; Manufacturer: Toshiba Semiconductor and Storage; Part Package: SOD-323; Obsolete Part: False; Component ID: 17; Part Value: 30V; Part Value 2: 200mA; Package Type: SMT
R120 R123 R126 R129 = 115: as R108 on sheet LIDO-HW.100.RearConnector; Part Value: 10K; Part Value 3: 1/10W; Package Type: SMT
R121 R124 R127 R130 = 118: RES SMD 4.7K OHM 1% 1/10W 0603; Manufacturer Part Number: ERJ-3EKF4701V; Manufacturer: Panasonic Electronic Components; Obsolete Part: False; Component ID: 118; Part Value: 4K7; Part Value 3: 1/10W; Package Type: SMT
R122 R125 R128 R131 = 103: RES SMD 20K OHM 1% 1/10W 0603; Manufacturer Part Number: ERJ-3EKF2002V; Manufacturer: Panasonic Electronic Components; Manufacturer Part Number 2nd: RC0603FR-0720KL; Manufacturer 2nd: YAGEO; Obsolete Part: False; Component ID: 103; Part Value: 20K; Part Value 3: 1/10W; Package Type: SMT
TP109-TP112 TP131 = 3: as TP100 on sheet LIDO-HW.100.VinAndPower; 02_Layer: *; 01_Diameter: 1mm